# Altium project Inv_filter_v2.PrjPcb
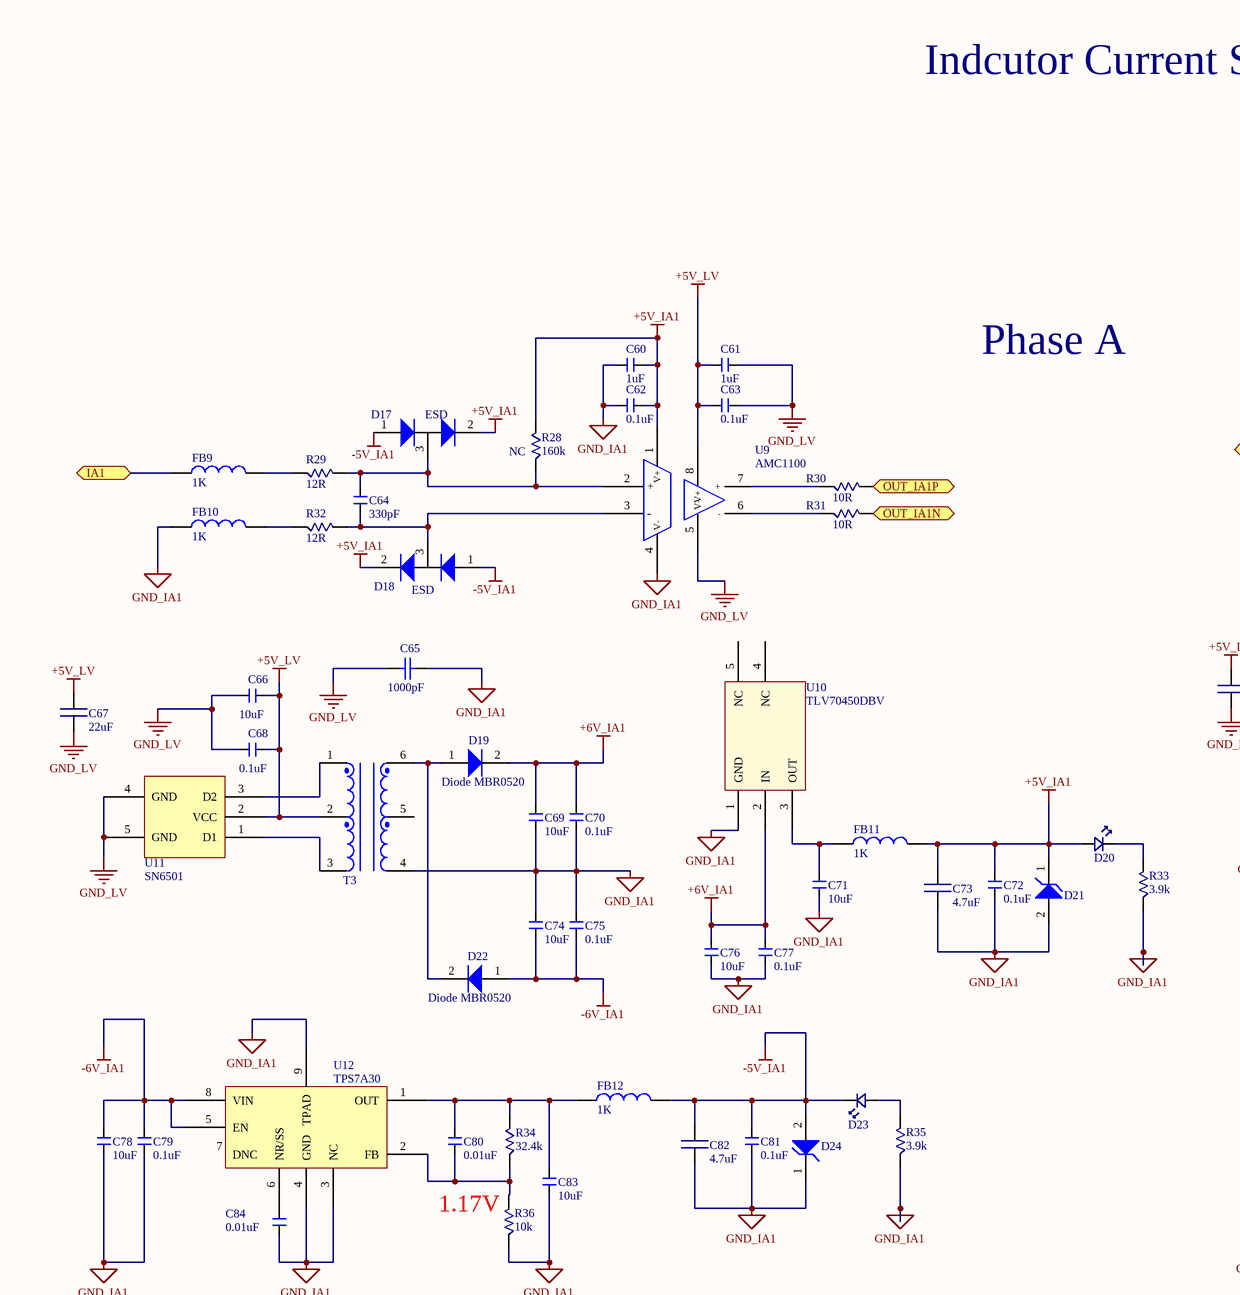
[diagram p0: Ind_current_sensor.SchDoc, top left]
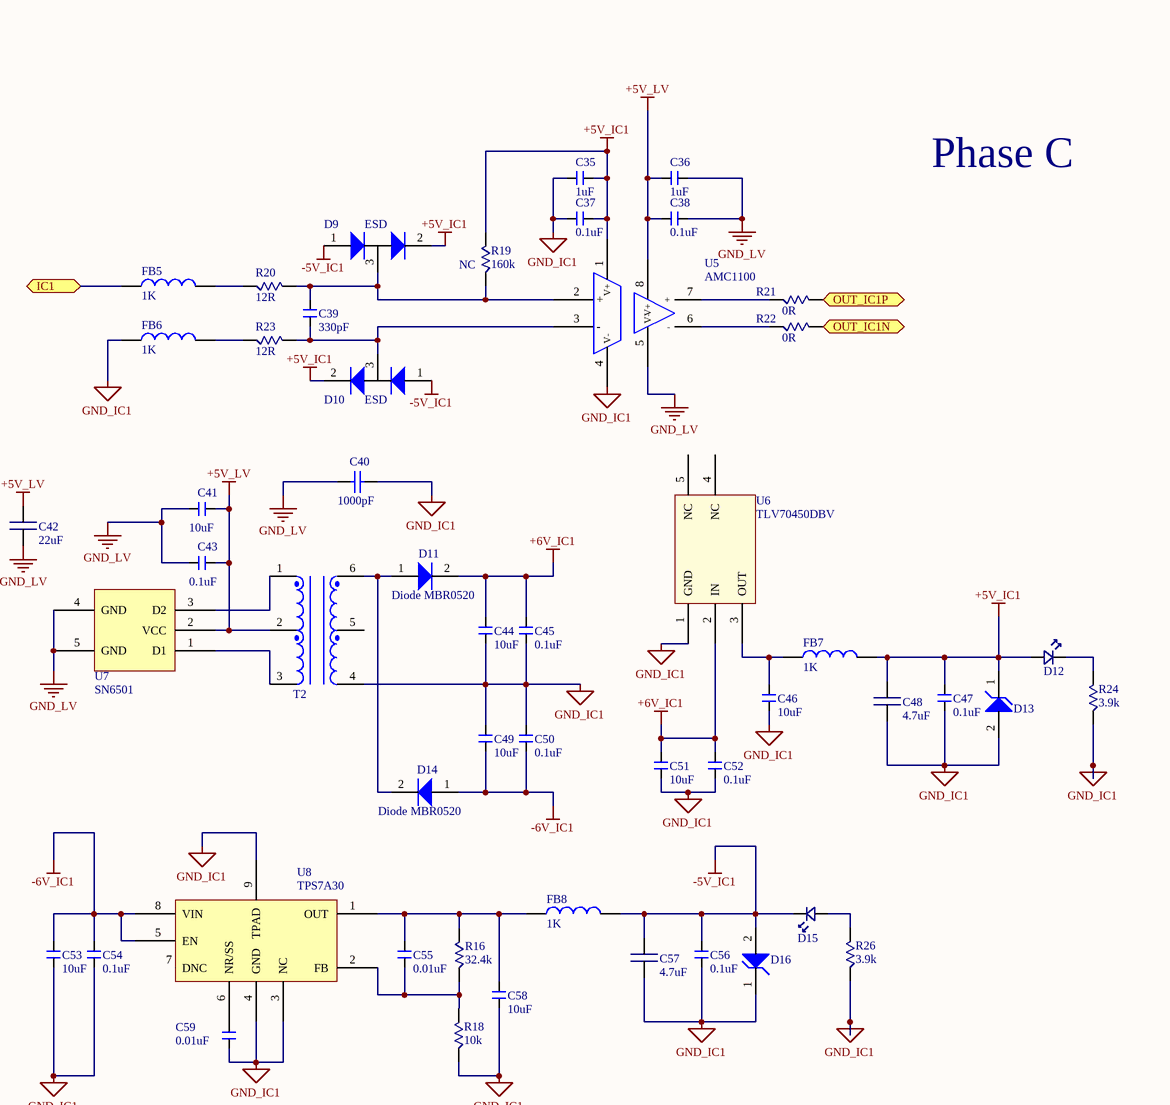
[diagram p1: Ind_current_sensor.SchDoc, top right]
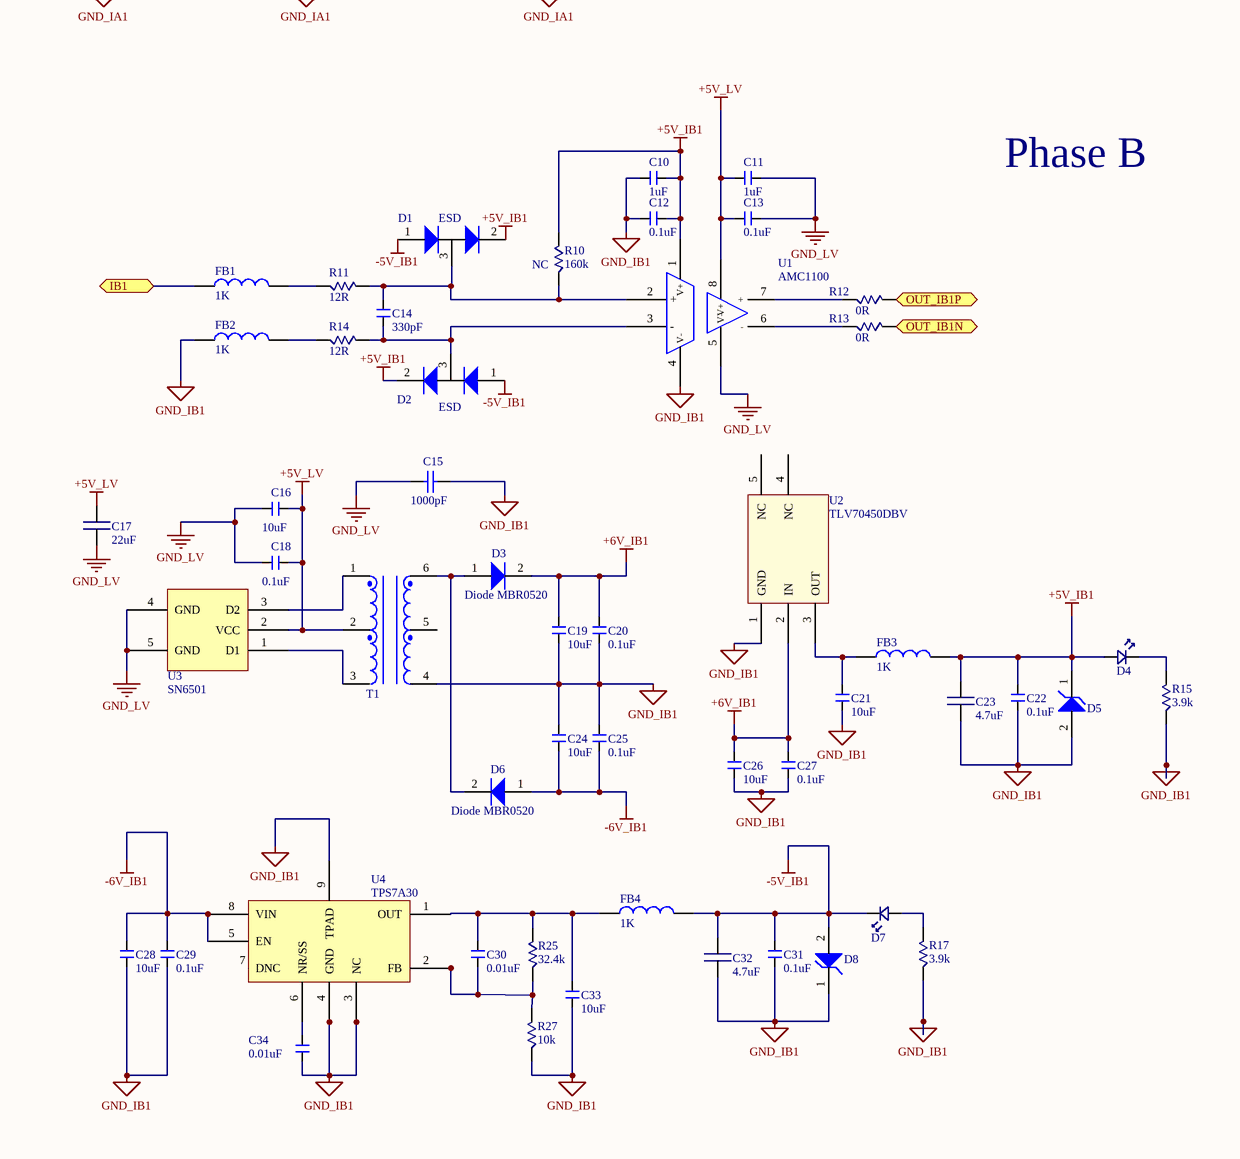
[diagram p2: Ind_current_sensor.SchDoc, bottom left]
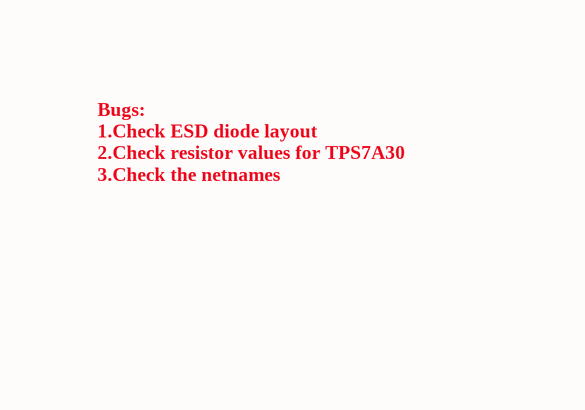
[diagram p3: Ind_current_sensor.SchDoc, bottom right]
3 sheets, 414 parts. Net scope: flat (ports and power ports of the same name join across sheets).
Board file: Inc_filter_v2.PcbDoc
Sheets:
  Ind_current_sensor.SchDoc
  Voltage_sensor_UVW.SchDoc
  Out_current_sensor_UVW.SchDoc

## Sheet Ind_current_sensor.SchDoc
size 508 x 508 mm

### Parts
C10  value 1uF  [0603 (1608 Metric)]  (hidden comment: Cap 0603_new)
C11  value 1uF  [0603 (1608 Metric)]  (hidden comment: Cap 0603_new)
C12  value 0.1uF  [0603 (1608 Metric)]  (hidden comment: Cap 0603_new)
C13  value 0.1uF  [0603 (1608 Metric)]  (hidden comment: Cap 0603_new)
C14  value 330pF  [0603 (1608 Metric)]  (hidden comment: Cap 0603_new)
C15  value 1000pF  [RAD-0.3]  (hidden comment: Cap TH)
C16  value 10uF  [0603 (1608 Metric)]  (hidden comment: Cap 0603_new)
C17  value 22uF  [0805 (2012 metric)]  (hidden comment: Cap 0805)
C18  value 0.1uF  [0603 (1608 Metric)]  (hidden comment: Cap 0603_new)
C19  value 10uF  [0603 (1608 Metric)]  (hidden comment: Cap 0603_new)
C20  value 0.1uF  [0603 (1608 Metric)]  (hidden comment: Cap 0603_new)
C21  value 10uF  [0603 (1608 Metric)]  (hidden comment: Cap 0603_new)
C22  value 0.1uF  [0603 (1608 Metric)]  (hidden comment: Cap 0603_new)
C23  value 4.7uF  [0805 (2012 metric)]  (hidden comment: Cap 0805)
C24  value 10uF  [0603 (1608 Metric)]  (hidden comment: Cap 0603_new)
C25  value 0.1uF  [0603 (1608 Metric)]  (hidden comment: Cap 0603_new)
C26  value 10uF  [0603 (1608 Metric)]  (hidden comment: Cap 0603_new)
C27  value 0.1uF  [0603 (1608 Metric)]  (hidden comment: Cap 0603_new)
C28  value 10uF  [0603 (1608 Metric)]  (hidden comment: Cap 0603_new)
C29  value 0.1uF  [0603 (1608 Metric)]  (hidden comment: Cap 0603_new)
C30  value 0.01uF  [0603 (1608 Metric)]  (hidden comment: Cap 0603_new)
C31  value 0.1uF  [0603 (1608 Metric)]  (hidden comment: Cap 0603_new)
C32  value 4.7uF  [0805 (2012 metric)]  (hidden comment: Cap 0805)
C33  value 10uF  [0603 (1608 Metric)]  (hidden comment: Cap 0603_new)
C34  value 0.01uF  [0603 (1608 Metric)]  (hidden comment: Cap 0603_new)
C35  value 1uF  [0603 (1608 Metric)]  (hidden comment: Cap 0603_new)
C36  value 1uF  [0603 (1608 Metric)]  (hidden comment: Cap 0603_new)
C37  value 0.1uF  [0603 (1608 Metric)]  (hidden comment: Cap 0603_new)
C38  value 0.1uF  [0603 (1608 Metric)]  (hidden comment: Cap 0603_new)
C39  value 330pF  [0603 (1608 Metric)]  (hidden comment: Cap 0603_new)
C40  value 1000pF  [RAD-0.3]  (hidden comment: Cap TH)
C41  value 10uF  [0603 (1608 Metric)]  (hidden comment: Cap 0603_new)
C42  value 22uF  [0805 (2012 metric)]  (hidden comment: Cap 0805)
C43  value 0.1uF  [0603 (1608 Metric)]  (hidden comment: Cap 0603_new)
C44  value 10uF  [0603 (1608 Metric)]  (hidden comment: Cap 0603_new)
C45  value 0.1uF  [0603 (1608 Metric)]  (hidden comment: Cap 0603_new)
C46  value 10uF  [0603 (1608 Metric)]  (hidden comment: Cap 0603_new)
C47  value 0.1uF  [0603 (1608 Metric)]  (hidden comment: Cap 0603_new)
C48  value 4.7uF  [0805 (2012 metric)]  (hidden comment: Cap 0805)
C49  value 10uF  [0603 (1608 Metric)]  (hidden comment: Cap 0603_new)
C50  value 0.1uF  [0603 (1608 Metric)]  (hidden comment: Cap 0603_new)
C51  value 10uF  [0603 (1608 Metric)]  (hidden comment: Cap 0603_new)
C52  value 0.1uF  [0603 (1608 Metric)]  (hidden comment: Cap 0603_new)
C53  value 10uF  [0603 (1608 Metric)]  (hidden comment: Cap 0603_new)
C54  value 0.1uF  [0603 (1608 Metric)]  (hidden comment: Cap 0603_new)
C55  value 0.01uF  [0603 (1608 Metric)]  (hidden comment: Cap 0603_new)
C56  value 0.1uF  [0603 (1608 Metric)]  (hidden comment: Cap 0603_new)
C57  value 4.7uF  [0805 (2012 metric)]  (hidden comment: Cap 0805)
C58  value 10uF  [0603 (1608 Metric)]  (hidden comment: Cap 0603_new)
C59  value 0.01uF  [0603 (1608 Metric)]  (hidden comment: Cap 0603_new)
C60  value 1uF  [0603 (1608 Metric)]  (hidden comment: Cap 0603_new)
C61  value 1uF  [0603 (1608 Metric)]  (hidden comment: Cap 0603_new)
C62  value 0.1uF  [0603 (1608 Metric)]  (hidden comment: Cap 0603_new)
C63  value 0.1uF  [0603 (1608 Metric)]  (hidden comment: Cap 0603_new)
C64  value 330pF  [0603 (1608 Metric)]  (hidden comment: Cap 0603_new)
C65  value 1000pF  [RAD-0.3]  (hidden comment: Cap TH)
C66  value 10uF  [0603 (1608 Metric)]  (hidden comment: Cap 0603_new)
C67  value 22uF  [0805 (2012 metric)]  (hidden comment: Cap 0805)
C68  value 0.1uF  [0603 (1608 Metric)]  (hidden comment: Cap 0603_new)
C69  value 10uF  [0603 (1608 Metric)]  (hidden comment: Cap 0603_new)
C70  value 0.1uF  [0603 (1608 Metric)]  (hidden comment: Cap 0603_new)
C71  value 10uF  [0603 (1608 Metric)]  (hidden comment: Cap 0603_new)
C72  value 0.1uF  [0603 (1608 Metric)]  (hidden comment: Cap 0603_new)
C73  value 4.7uF  [0805 (2012 metric)]  (hidden comment: Cap 0805)
C74  value 10uF  [0603 (1608 Metric)]  (hidden comment: Cap 0603_new)
C75  value 0.1uF  [0603 (1608 Metric)]  (hidden comment: Cap 0603_new)
C76  value 10uF  [0603 (1608 Metric)]  (hidden comment: Cap 0603_new)
C77  value 0.1uF  [0603 (1608 Metric)]  (hidden comment: Cap 0603_new)
C78  value 10uF  [0603 (1608 Metric)]  (hidden comment: Cap 0603_new)
C79  value 0.1uF  [0603 (1608 Metric)]  (hidden comment: Cap 0603_new)
C80  value 0.01uF  [0603 (1608 Metric)]  (hidden comment: Cap 0603_new)
C81  value 0.1uF  [0603 (1608 Metric)]  (hidden comment: Cap 0603_new)
C82  value 4.7uF  [0805 (2012 metric)]  (hidden comment: Cap 0805)
C83  value 10uF  [0603 (1608 Metric)]  (hidden comment: Cap 0603_new)
C84  value 0.01uF  [0603 (1608 Metric)]  (hidden comment: Cap 0603_new)
D1  value ESD  [SOT323_ESD]  (hidden comment: TVS - Diodes)
D2  value ESD  [SOT323_ESD]  (hidden comment: TVS - Diodes)
D3  Diode MBR0520  [SOD-123]
D4  LED  [0805 (2012 Metric) Diode]  (value not drawn)
D5  Diode Zener POWERDI123  [POWERDI]  (value not drawn)
D6  Diode MBR0520  [SOD-123]
D7  LED  [0805 (2012 Metric) Diode]  (value not drawn)
D8  Diode Zener POWERDI123  [POWERDI]  (value not drawn)
D9  value ESD  [SOT323_ESD]  (hidden comment: TVS - Diodes)
D10  value ESD  [SOT323_ESD]  (hidden comment: TVS - Diodes)
D11  Diode MBR0520  [SOD-123]
D12  LED  [0805 (2012 Metric) Diode]  (value not drawn)
D13  Diode Zener POWERDI123  [POWERDI]  (value not drawn)
D14  Diode MBR0520  [SOD-123]
D15  LED  [0805 (2012 Metric) Diode]  (value not drawn)
D16  Diode Zener POWERDI123  [POWERDI]  (value not drawn)
D17  value ESD  [SOT323_ESD]  (hidden comment: TVS - Diodes)
D18  value ESD  [SOT323_ESD]  (hidden comment: TVS - Diodes)
D19  Diode MBR0520  [SOD-123]
D20  LED  [0805 (2012 Metric) Diode]  (value not drawn)
D21  Diode Zener POWERDI123  [POWERDI]  (value not drawn)
D22  Diode MBR0520  [SOD-123]
D23  LED  [0805 (2012 Metric) Diode]  (value not drawn)
D24  Diode Zener POWERDI123  [POWERDI]  (value not drawn)
FB1  value 1K  [0603 (1608 Metric)]  (hidden comment: Ferrite bead)
FB2  value 1K  [0603 (1608 Metric)]  (hidden comment: Ferrite bead)
FB3  value 1K  [0603 (1608 Metric)]  (hidden comment: Ferrite bead)
FB4  value 1K  [0603 (1608 Metric)]  (hidden comment: Ferrite bead)
FB5  value 1K  [0603 (1608 Metric)]  (hidden comment: Ferrite bead)
FB6  value 1K  [0603 (1608 Metric)]  (hidden comment: Ferrite bead)
FB7  value 1K  [0603 (1608 Metric)]  (hidden comment: Ferrite bead)
FB8  value 1K  [0603 (1608 Metric)]  (hidden comment: Ferrite bead)
FB9  value 1K  [0603 (1608 Metric)]  (hidden comment: Ferrite bead)
FB10  value 1K  [0603 (1608 Metric)]  (hidden comment: Ferrite bead)
FB11  value 1K  [0603 (1608 Metric)]  (hidden comment: Ferrite bead)
FB12  value 1K  [0603 (1608 Metric)]  (hidden comment: Ferrite bead)
R10  NC  value 160k  [0603 (1608 Metric)]
R11  value 12R  [1206]  (hidden comment: Resistor 1206)
R12  value 0R  [0603 (1608 Metric)]  (hidden comment: Resistor 0603)
R13  value 0R  [0603 (1608 Metric)]  (hidden comment: Resistor 0603)
R14  value 12R  [1206]  (hidden comment: Resistor 1206)
R15  value 3.9k  [0603 (1608 Metric)]  (hidden comment: Resistor 0603)
R16  value 32.4k  [0603 (1608 Metric)]  (hidden comment: Resistor 0603)
R17  value 3.9k  [0603 (1608 Metric)]  (hidden comment: Resistor 0603)
R18  value 10k  [0603 (1608 Metric)]  (hidden comment: Resistor 0603)
R19  NC  value 160k  [0603 (1608 Metric)]
R20  value 12R  [1206]  (hidden comment: Resistor 1206)
R21  value 0R  [0603 (1608 Metric)]  (hidden comment: Resistor 0603)
R22  value 0R  [0603 (1608 Metric)]  (hidden comment: Resistor 0603)
R23  value 12R  [1206]  (hidden comment: Resistor 1206)
R24  value 3.9k  [0603 (1608 Metric)]  (hidden comment: Resistor 0603)
R25  value 32.4k  [0603 (1608 Metric)]  (hidden comment: Resistor 0603)
R26  value 3.9k  [0603 (1608 Metric)]  (hidden comment: Resistor 0603)
R27  value 10k  [0603 (1608 Metric)]  (hidden comment: Resistor 0603)
R28  NC  value 160k  [0603 (1608 Metric)]
R29  value 12R  [1206]  (hidden comment: Resistor 1206)
R30  value 10R  [0603 (1608 Metric)]  (hidden comment: Resistor 0603)
R31  value 10R  [0603 (1608 Metric)]  (hidden comment: Resistor 0603)
R32  value 12R  [1206]  (hidden comment: Resistor 1206)
R33  value 3.9k  [0603 (1608 Metric)]  (hidden comment: Resistor 0603)
R34  value 32.4k  [0603 (1608 Metric)]  (hidden comment: Resistor 0603)
R35  value 3.9k  [0603 (1608 Metric)]  (hidden comment: Resistor 0603)
R36  value 10k  [0603 (1608 Metric)]  (hidden comment: Resistor 0603)
T1  750313769  [Xmr SN6501]  (value not drawn)
T2  750313769  [Xmr SN6501]  (value not drawn)
T3  750313769  [Xmr SN6501]  (value not drawn)
U1  AMC1100  [SOIC8]
U2  TLV70450DBV  [SOT23-5]
U3  SN6501  [SOT23-5]
U4  TPS7A30  [8-TSSOP]
U5  AMC1100  [SOIC8]
U6  TLV70450DBV  [SOT23-5]
U7  SN6501  [SOT23-5]
U8  TPS7A30  [8-TSSOP]
U9  AMC1100  [SOIC8]
U10  TLV70450DBV  [SOT23-5]
U11  SN6501  [SOT23-5]
U12  TPS7A30  [8-TSSOP]

### Ports
IA1, IB1, IC1, OUT_IA1N, OUT_IA1P, OUT_IB1N, OUT_IB1P, OUT_IC1N, OUT_IC1P

### Nets
+5V_IA1: C60.2(OUT) C62.2(OUT) C72.2(OUT) C73.2(OUT) D17.2(node) D18.2(node) D20.A D21.1(Anode) FB11.2(OUT) R28.2(A) U9.1(V+)
+5V_IB1: C10.2(OUT) C12.2(OUT) C22.2(OUT) C23.2(OUT) D1.2(node) D2.2(node) D4.A D5.1(Anode) FB3.2(OUT) R10.2(A) U1.1(V+)
+5V_IC1: C35.2(OUT) C37.2(OUT) C47.2(OUT) C48.2(OUT) D9.2(node) D10.2(node) D12.A D13.1(Anode) FB7.2(OUT) R19.2(A) U5.1(V+)
+5V_LV: C11.1(OUT) C13.1(OUT) C16.2(OUT) C17.2(OUT) C18.2(OUT) C36.1(OUT) C38.1(OUT) C41.2(OUT) C42.2(OUT) C43.2(OUT) C61.1(OUT) C63.1(OUT) C66.2(OUT) C67.2(OUT) C68.2(OUT) T1.2 T2.2 T3.2 U1.8(V+) U3.2(VCC) U5.8(V+) U7.2(VCC) U9.8(V+) U11.2(VCC)
+6V_IA1: C69.2(OUT) C70.2(OUT) C76.2(OUT) C77.2(OUT) D19.2(Anode) U10.2(IN)
+6V_IB1: C19.2(OUT) C20.2(OUT) C26.2(OUT) C27.2(OUT) D3.2(Anode) U2.2(IN)
+6V_IC1: C44.2(OUT) C45.2(OUT) C51.2(OUT) C52.2(OUT) D11.2(Anode) U6.2(IN)
-5V_IA1: C81.2(OUT) C82.2(OUT) D17.1(node) D18.1(node) D23.K D24.2(Anode) FB12.2(OUT)
-5V_IB1: C31.2(OUT) C32.2(OUT) D1.1(node) D2.1(node) D7.K D8.2(Anode) FB4.2(OUT)
-5V_IC1: C56.2(OUT) C57.2(OUT) D9.1(node) D10.1(node) D15.K D16.2(Anode) FB8.2(OUT)
-6V_IA1: C74.1(OUT) C75.1(OUT) C78.2(OUT) C79.2(OUT) D22.1(Anode) U12.5(EN) U12.8(VIN)
-6V_IB1: C24.1(OUT) C25.1(OUT) C28.2(OUT) C29.2(OUT) D6.1(Anode) U4.5(EN) U4.8(VIN)
-6V_IC1: C49.1(OUT) C50.1(OUT) C53.2(OUT) C54.2(OUT) D14.1(Anode) U8.5(EN) U8.8(VIN)
GND_IA1: C60.1(OUT) C62.1(OUT) C65.2 C69.1(OUT) C70.1(OUT) C71.1(OUT) C72.1(OUT) C73.1(OUT) C74.2(OUT) C75.2(OUT) C76.1(OUT) C77.1(OUT) C78.1(OUT) C79.1(OUT) C81.1(OUT) C82.1(OUT) C83.1(OUT) C84.1(OUT) D21.2(Anode) D24.1(Anode) FB10.1(OUT) R33.1(A) R35.1(A) R36.1(A) T3.4 U9.4(V-) U10.1(GND) U12.3(NC) U12.4(GND) U12.9(TPAD)
GND_IB1: C10.1(OUT) C12.1(OUT) C15.2 C19.1(OUT) C20.1(OUT) C21.1(OUT) C22.1(OUT) C23.1(OUT) C24.2(OUT) C25.2(OUT) C26.1(OUT) C27.1(OUT) C28.1(OUT) C29.1(OUT) C31.1(OUT) C32.1(OUT) C33.1(OUT) C34.1(OUT) D5.2(Anode) D8.1(Anode) FB2.1(OUT) R15.1(A) R17.1(A) R27.1(A) T1.4 U1.4(V-) U2.1(GND) U4.3(NC) U4.4(GND) U4.9(TPAD)
GND_IC1: C35.1(OUT) C37.1(OUT) C40.2 C44.1(OUT) C45.1(OUT) C46.1(OUT) C47.1(OUT) C48.1(OUT) C49.2(OUT) C50.2(OUT) C51.1(OUT) C52.1(OUT) C53.1(OUT) C54.1(OUT) C56.1(OUT) C57.1(OUT) C58.1(OUT) C59.1(OUT) D13.2(Anode) D16.1(Anode) FB6.1(OUT) R18.1(A) R24.1(A) R26.1(A) T2.4 U5.4(V-) U6.1(GND) U8.3(NC) U8.4(GND) U8.9(TPAD)
GND_LV: C11.2(OUT) C13.2(OUT) C15.1 C16.1(OUT) C17.1(OUT) C18.1(OUT) C36.2(OUT) C38.2(OUT) C40.1 C41.1(OUT) C42.1(OUT) C43.1(OUT) C61.2(OUT) C63.2(OUT) C65.1 C66.1(OUT) C67.1(OUT) C68.1(OUT) U1.5(V-) U3.4(GND) U3.5(GND) U5.5(V-) U7.4(GND) U7.5(GND) U9.5(V-) U11.4(GND) U11.5(GND)
NetC14_1: C14.1(OUT) D1.3(node) R10.1(A) R11.2(A) U1.2(+)
NetC14_2: C14.2(OUT) D2.3(node) R14.2(A) U1.3(-)
NetC21_2: C21.2(OUT) FB3.1(OUT) U2.3(OUT)
NetC30_1: C30.1(OUT) C33.2(OUT) FB4.1(OUT) R25.2(A) U4.1(OUT)
NetC30_2: C30.2(OUT) R25.1(A) R27.2(A) U4.2(FB)
NetC34_2: C34.2(OUT) U4.6(NR/SS)
NetC39_1: C39.1(OUT) D9.3(node) R19.1(A) R20.2(A) U5.2(+)
NetC39_2: C39.2(OUT) D10.3(node) R23.2(A) U5.3(-)
NetC46_2: C46.2(OUT) FB7.1(OUT) U6.3(OUT)
NetC55_1: C55.1(OUT) C58.2(OUT) FB8.1(OUT) R16.2(A) U8.1(OUT)
NetC55_2: C55.2(OUT) R16.1(A) R18.2(A) U8.2(FB)
NetC59_2: C59.2(OUT) U8.6(NR/SS)
NetC64_1: C64.1(OUT) D17.3(node) R28.1(A) R29.2(A) U9.2(+)
NetC64_2: C64.2(OUT) D18.3(node) R32.2(A) U9.3(-)
NetC71_2: C71.2(OUT) FB11.1(OUT) U10.3(OUT)
NetC80_1: C80.1(OUT) C83.2(OUT) FB12.1(OUT) R34.2(A) U12.1(OUT)
NetC80_2: C80.2(OUT) R34.1(A) R36.2(A) U12.2(FB)
NetC84_2: C84.2(OUT) U12.6(NR/SS)
NetD3_1: D3.1(Anode) D6.2(Anode) T1.6
NetD4_K: D4.K R15.2(A)
NetD7_A: D7.A R17.2(A)
NetD11_1: D11.1(Anode) D14.2(Anode) T2.6
NetD12_K: D12.K R24.2(A)
NetD15_A: D15.A R26.2(A)
NetD19_1: D19.1(Anode) D22.2(Anode) T3.6
NetD20_K: D20.K R33.2(A)
NetD23_A: D23.A R35.2(A)
NetFB1_1: FB1.1(OUT) ; port IB1
NetFB1_2: FB1.2(OUT) R11.1(A)
NetFB2_2: FB2.2(OUT) R14.1(A)
NetFB5_1: FB5.1(OUT) ; port IC1
NetFB5_2: FB5.2(OUT) R20.1(A)
NetFB6_2: FB6.2(OUT) R23.1(A)
NetFB9_1: FB9.1(OUT) ; port IA1
NetFB9_2: FB9.2(OUT) R29.1(A)
NetFB10_2: FB10.2(OUT) R32.1(A)
NetR12_1: R12.1(A) U1.7(+)
NetR12_2: R12.2(A) ; port OUT_IB1P
NetR13_1: R13.1(A) U1.6(-)
NetR13_2: R13.2(A) ; port OUT_IB1N
NetR21_1: R21.1(A) U5.7(+)
NetR21_2: R21.2(A) ; port OUT_IC1P
NetR22_1: R22.1(A) U5.6(-)
NetR22_2: R22.2(A) ; port OUT_IC1N
NetR30_1: R30.1(A) U9.7(+)
NetR30_2: R30.2(A) ; port OUT_IA1P
NetR31_1: R31.1(A) U9.6(-)
NetR31_2: R31.2(A) ; port OUT_IA1N
NetT1_1: T1.1 U3.3(D2)
NetT1_3: T1.3 U3.1(D1)
NetT2_1: T2.1 U7.3(D2)
NetT2_3: T2.3 U7.1(D1)
NetT3_1: T3.1 U11.3(D2)
NetT3_3: T3.3 U11.1(D1)

Not connected (* = marked no-connect by the designer): T1 5(1); T2 5(1); T3 5(1); U2 4(NC) 5(NC); U4 7(DNC); U6 4(NC) 5(NC); U8 7(DNC); U10 4(NC) 5(NC); U12 7(DNC)

### Notes on the sheet
- Indcutor Current Sensors
- Phase C
- Phase A
- (near R36) 1.17V
- Phase B
- Bugs:
  1.Check ESD diode layout
  2.Check resistor values for TPS7A30
  3.Check the netnames

### Library data of the parts
C10 C11 C35 C36 C60 C61 = Cap 0603_new: CAP CER 1UF 50V X5R 0603; part: 1276-1860-1-ND
C12 C13 C18 C20 C22 C25 C27 C29 C31 C37 C38 C43 C45 C47 C50 C52 C54 C56 C62 C63 C68 C70 C72 C75 C77 C79 C81 = Cap 0603_new: CAP CER 0.1UF 50V Y5V 0603; part: 311-1343-6-ND
C14 C39 C64 = Cap 0603_new: CAP CER 330PF 50V C0G 0603; part: 445-7033-2-ND
C15 C40 C65 = Cap: CAP CER 1000PF 1KV Y5P RADIAL; Part: 1251PH-ND; Published: 8-Jun-2000; LatestRevisionDate: 17-Jul-2002; LatestRevisionNote: Re-released for DXP Platform.; PackageReference: RAD-0.3; Publisher: Altium Limited; PackageDescription: Radial Cap, Thru-Hole; 2 Leads; 0.3 in Pin Spacing
C16 C19 C21 C24 C26 C28 C33 C41 C44 C46 C49 C51 C53 C58 C66 C69 C71 C74 C76 C78 C83 = Cap 0603_new: CAP CER 10UF 35V X5R 0805; part: 490-10515-1-ND
C17 C42 C67 = Cap 0805: CAP CER 22UF 35V X5R 0805; Part: 445-14428-1-ND
C23 C32 C48 C57 C73 C82 = Cap 0805: CAP CER 4.7UF 50V X5R 0805; Part: 445-5980-1-ND
C30 C34 C55 C59 C80 C84 = Cap 0603_new: CAP CER 10000PF 100V X7R 0603; part: 478-7418-1-ND
D1 D2 D9 D10 D17 D18 = Diode_ESD: TVS DIODE; Part: ESD1P0RFWH6327XTSA1CT
D3 D6 D11 D14 D19 D22 = Diode MBR0520: DIODE SCHOTTKY 20V 500MA SOD123; Part: MBR0520LT1GOSCT-ND; Value: *
D4 D7 D12 D15 D20 D23 = LED: LED 0805
D5 D8 D13 D16 D21 D24 = Diode Zener POWERDI123: Part: DFLZ6V2DICT-ND; Value: *
FB1-FB12 = Ferrite bead: FERRITE BEAD 1 KOHM 0603 1LN; Part: 445-8672-1-ND
R10 R19 R28 = Resistor 0603
R11 R14 R20 R23 R29 R32 = Resistor 1206: 12 Ohm ±0.5% 0.25W, 1/4W Chip Resistor 1206; Part: 311-2961-1-ND
R12 R13 R21 R22 R30 R31 = Resistor 0603: RES SMD 10 OHM 0.05% 1/10W 0603; Part: RNCF0603AKT10R0CT-ND
R15 R17 R24 R26 R33 R35 = Resistor 0603: RES SMD 3.9K OHM 5% 1/10W 0603; Part: 541-3.9KGCT-ND
R16 R25 R34 = Resistor 0603: RES SMD 32.4KOHM 0.5% 1/10W 0603; Part: 311-32.4KDCT-ND
R18 R27 R36 = Resistor 0603: RES SMD 10K OHM 0.5% 1/16W 0603; Part: RR08P10.0KDCT-ND
T1-T3 = 750313769: TRANSFORMER SMD TR1.7 SN6501; Part: 1297-1107-1-ND
U1 U5 U9 = AMC1100: IC OPAMP ISOLATION 100KHZ 8SOIC; Part: 296-38822-5-ND
U2 U6 U10 = TLV70450DBV: IC REG LDO 5V 0.15A SOT23-5; Part: 296-39287-1-ND
U3 U7 U11 = SN6501: IC REG CONV PWR SUPPLIES SOT23-5; Part: 296-37700-1-ND; Value: *
U4 U8 U12 = TPS7A30: IC REG LDO NEG ADJ 0.2A 8MSOP; Part: 296-27750-1-ND

## Sheet Voltage_sensor_UVW.SchDoc
size 381 x 457 mm
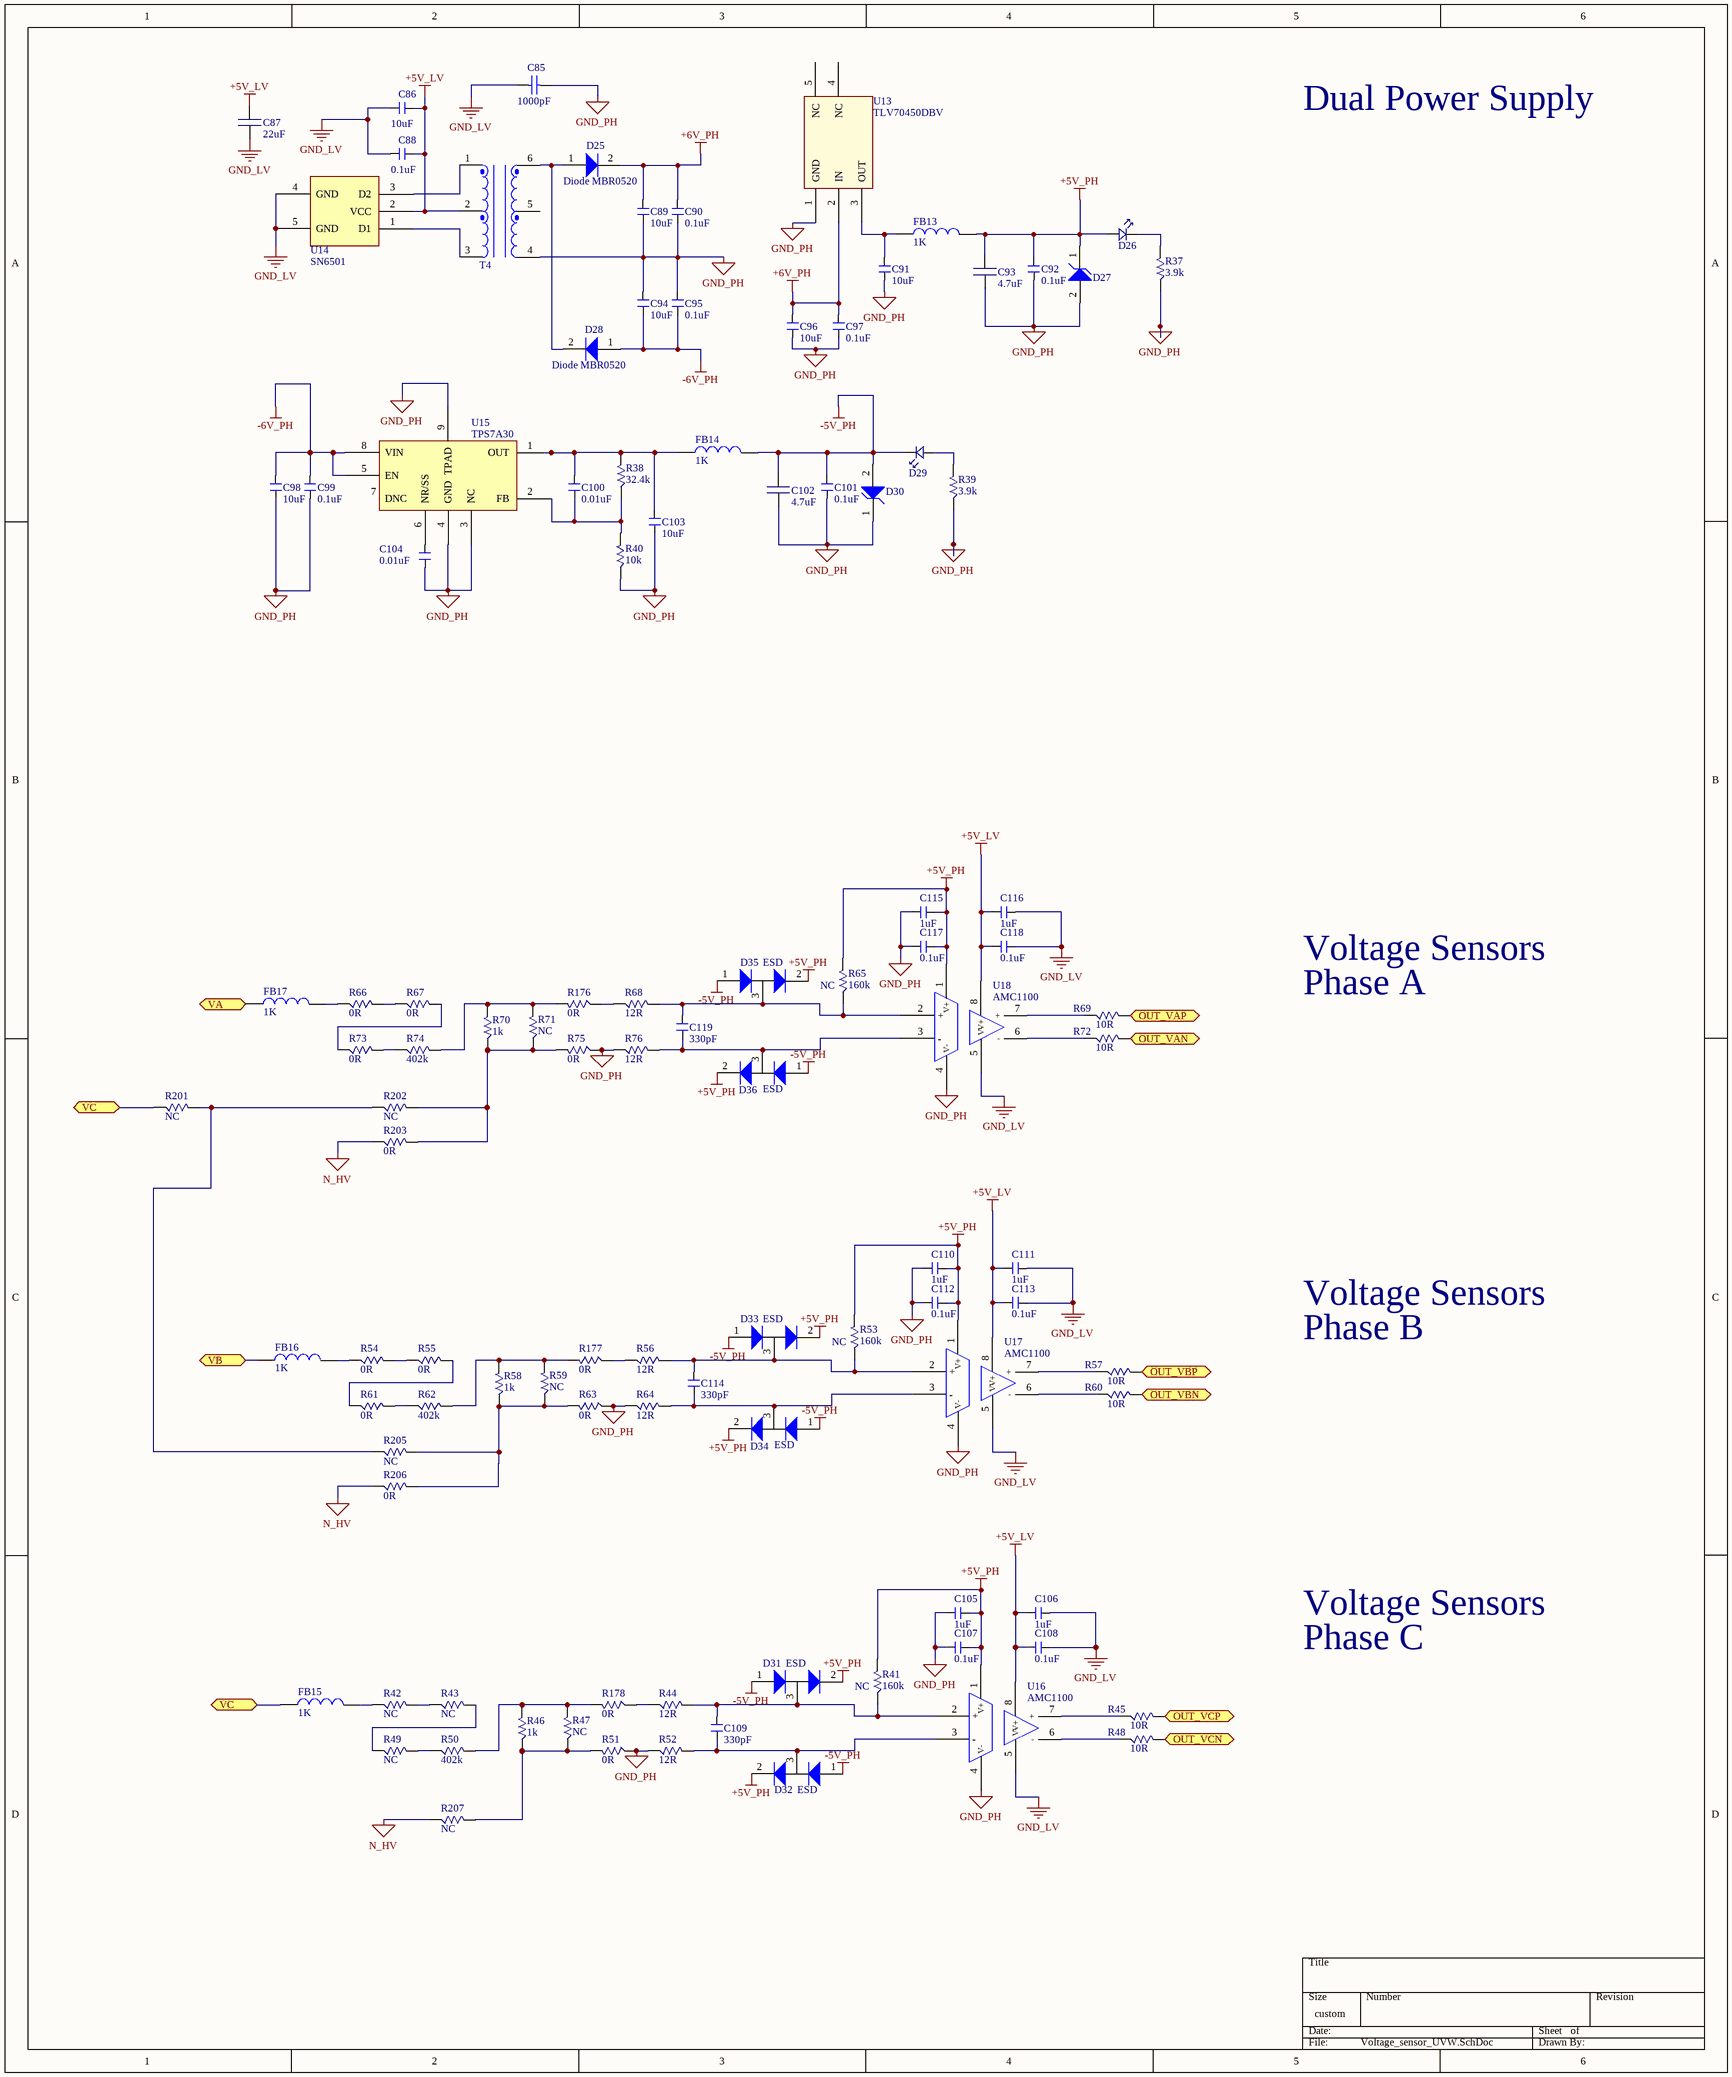
[diagram p4: Voltage_sensor_UVW.SchDoc]

### Parts
C85  value 1000pF  [RAD-0.3]  (hidden comment: Cap TH)
C86  value 10uF  [0603 (1608 Metric)]  (hidden comment: Cap 0603_new)
C87  value 22uF  [0805 (2012 metric)]  (hidden comment: Cap 0805)
C88  value 0.1uF  [0603 (1608 Metric)]  (hidden comment: Cap 0603_new)
C89  value 10uF  [0603 (1608 Metric)]  (hidden comment: Cap 0603_new)
C90  value 0.1uF  [0603 (1608 Metric)]  (hidden comment: Cap 0603_new)
C91  value 10uF  [0603 (1608 Metric)]  (hidden comment: Cap 0603_new)
C92  value 0.1uF  [0603 (1608 Metric)]  (hidden comment: Cap 0603_new)
C93  value 4.7uF  [0805 (2012 metric)]  (hidden comment: Cap 0805)
C94  value 10uF  [0603 (1608 Metric)]  (hidden comment: Cap 0603_new)
C95  value 0.1uF  [0603 (1608 Metric)]  (hidden comment: Cap 0603_new)
C96  value 10uF  [0603 (1608 Metric)]  (hidden comment: Cap 0603_new)
C97  value 0.1uF  [0603 (1608 Metric)]  (hidden comment: Cap 0603_new)
C98  value 10uF  [0603 (1608 Metric)]  (hidden comment: Cap 0603_new)
C99  value 0.1uF  [0603 (1608 Metric)]  (hidden comment: Cap 0603_new)
C100  value 0.01uF  [0603 (1608 Metric)]  (hidden comment: Cap 0603_new)
C101  value 0.1uF  [0603 (1608 Metric)]  (hidden comment: Cap 0603_new)
C102  value 4.7uF  [0805 (2012 metric)]  (hidden comment: Cap 0805)
C103  value 10uF  [0603 (1608 Metric)]  (hidden comment: Cap 0603_new)
C104  value 0.01uF  [0603 (1608 Metric)]  (hidden comment: Cap 0603_new)
C105  value 1uF  [0603 (1608 Metric)]  (hidden comment: Cap 0603_new)
C106  value 1uF  [0603 (1608 Metric)]  (hidden comment: Cap 0603_new)
C107  value 0.1uF  [0603 (1608 Metric)]  (hidden comment: Cap 0603_new)
C108  value 0.1uF  [0603 (1608 Metric)]  (hidden comment: Cap 0603_new)
C109  value 330pF  [0603 (1608 Metric)]  (hidden comment: Cap 0603_new)
C110  value 1uF  [0603 (1608 Metric)]  (hidden comment: Cap 0603_new)
C111  value 1uF  [0603 (1608 Metric)]  (hidden comment: Cap 0603_new)
C112  value 0.1uF  [0603 (1608 Metric)]  (hidden comment: Cap 0603_new)
C113  value 0.1uF  [0603 (1608 Metric)]  (hidden comment: Cap 0603_new)
C114  value 330pF  [0603 (1608 Metric)]  (hidden comment: Cap 0603_new)
C115  value 1uF  [0603 (1608 Metric)]  (hidden comment: Cap 0603_new)
C116  value 1uF  [0603 (1608 Metric)]  (hidden comment: Cap 0603_new)
C117  value 0.1uF  [0603 (1608 Metric)]  (hidden comment: Cap 0603_new)
C118  value 0.1uF  [0603 (1608 Metric)]  (hidden comment: Cap 0603_new)
C119  value 330pF  [0603 (1608 Metric)]  (hidden comment: Cap 0603_new)
D25  Diode MBR0520  [SOD-123]
D26  LED  [0805 (2012 Metric) Diode]  (value not drawn)
D27  Diode Zener POWERDI123  [POWERDI]  (value not drawn)
D28  Diode MBR0520  [SOD-123]
D29  LED  [0805 (2012 Metric) Diode]  (value not drawn)
D30  Diode Zener POWERDI123  [POWERDI]  (value not drawn)
D31  value ESD  [SOT323_ESD]  (hidden comment: TVS - Diodes)
D32  value ESD  [SOT323_ESD]  (hidden comment: TVS - Diodes)
D33  value ESD  [SOT323_ESD]  (hidden comment: TVS - Diodes)
D34  value ESD  [SOT323_ESD]  (hidden comment: TVS - Diodes)
D35  value ESD  [SOT323_ESD]  (hidden comment: TVS - Diodes)
D36  value ESD  [SOT323_ESD]  (hidden comment: TVS - Diodes)
FB13  value 1K  [0603 (1608 Metric)]  (hidden comment: Ferrite bead)
FB14  value 1K  [0603 (1608 Metric)]  (hidden comment: Ferrite bead)
FB15  value 1K  [0603 (1608 Metric)]  (hidden comment: Ferrite bead)
FB16  value 1K  [0603 (1608 Metric)]  (hidden comment: Ferrite bead)
FB17  value 1K  [0603 (1608 Metric)]  (hidden comment: Ferrite bead)
R37  value 3.9k  [0603 (1608 Metric)]  (hidden comment: Resistor 0603)
R38  value 32.4k  [0603 (1608 Metric)]  (hidden comment: Resistor 0603)
R39  value 3.9k  [0603 (1608 Metric)]  (hidden comment: Resistor 0603)
R40  value 10k  [0603 (1608 Metric)]  (hidden comment: Resistor 0603)
R41  NC  value 160k  [0603 (1608 Metric)]
R42  value NC  [1206]  (hidden comment: Resistor 1206)
R43  value NC  [1206]  (hidden comment: Resistor 1206)
R44  value 12R  [1206]  (hidden comment: Resistor 1206)
R45  value 10R  [0603 (1608 Metric)]  (hidden comment: Resistor 0603)
R46  value 1k  [1206]  (hidden comment: Resistor 1206)
R47  value NC  [1206]  (hidden comment: Resistor 1206)
R48  value 10R  [0603 (1608 Metric)]  (hidden comment: Resistor 0603)
R49  value NC  [1206]  (hidden comment: Resistor 1206)
R50  value 402k  [1206]  (hidden comment: Resistor 1206)
R51  value 0R  [0603 (1608 Metric)]  (hidden comment: Resistor 0603)
R52  value 12R  [1206]  (hidden comment: Resistor 1206)
R53  NC  value 160k  [0603 (1608 Metric)]
R54  value 0R  [1206]  (hidden comment: Resistor 1206)
R55  value 0R  [1206]  (hidden comment: Resistor 1206)
R56  value 12R  [1206]  (hidden comment: Resistor 1206)
R57  value 10R  [0603 (1608 Metric)]  (hidden comment: Resistor 0603)
R58  value 1k  [1206]  (hidden comment: Resistor 1206)
R59  value NC  [1206]  (hidden comment: Resistor 1206)
R60  value 10R  [0603 (1608 Metric)]  (hidden comment: Resistor 0603)
R61  value 0R  [1206]  (hidden comment: Resistor 1206)
R62  value 402k  [1206]  (hidden comment: Resistor 1206)
R63  value 0R  [0603 (1608 Metric)]  (hidden comment: Resistor 0603)
R64  value 12R  [1206]  (hidden comment: Resistor 1206)
R65  NC  value 160k  [0603 (1608 Metric)]
R66  value 0R  [1206]  (hidden comment: Resistor 1206)
R67  value 0R  [1206]  (hidden comment: Resistor 1206)
R68  value 12R  [1206]  (hidden comment: Resistor 1206)
R69  value 10R  [0603 (1608 Metric)]  (hidden comment: Resistor 0603)
R70  value 1k  [1206]  (hidden comment: Resistor 1206)
R71  value NC  [1206]  (hidden comment: Resistor 1206)
R72  value 10R  [0603 (1608 Metric)]  (hidden comment: Resistor 0603)
R73  value 0R  [1206]  (hidden comment: Resistor 1206)
R74  value 402k  [1206]  (hidden comment: Resistor 1206)
R75  value 0R  [0603 (1608 Metric)]  (hidden comment: Resistor 0603)
R76  value 12R  [1206]  (hidden comment: Resistor 1206)
R176  value 0R  [0603 (1608 Metric)]  (hidden comment: Resistor 0603)
R177  value 0R  [0603 (1608 Metric)]  (hidden comment: Resistor 0603)
R178  value 0R  [0603 (1608 Metric)]  (hidden comment: Resistor 0603)
R201  value NC  [1206]  (hidden comment: Resistor 1206)
R202  value NC  [1206]  (hidden comment: Resistor 1206)
R203  value 0R  [1206]  (hidden comment: Resistor 1206)
R205  value NC  [1206]  (hidden comment: Resistor 1206)
R206  value 0R  [1206]  (hidden comment: Resistor 1206)
R207  value NC  [1206]  (hidden comment: Resistor 1206)
T4  750313769  [Xmr SN6501]  (value not drawn)
U13  TLV70450DBV  [SOT23-5]
U14  SN6501  [SOT23-5]
U15  TPS7A30  [8-TSSOP]
U16  AMC1100  [SOIC8]
U17  AMC1100  [SOIC8]
U18  AMC1100  [SOIC8]

### Ports
OUT_VAN, OUT_VAP, OUT_VBN, OUT_VBP, OUT_VCN, OUT_VCP, VA, VB, VC

### Nets
+5V_LV: C86.2(OUT) C87.2(OUT) C88.2(OUT) C106.1(OUT) C108.1(OUT) C111.1(OUT) C113.1(OUT) C116.1(OUT) C118.1(OUT) T4.2 U14.2(VCC) U16.8(V+) U17.8(V+) U18.8(V+)
+5V_PH: C92.2(OUT) C93.2(OUT) C105.2(OUT) C107.2(OUT) C110.2(OUT) C112.2(OUT) C115.2(OUT) C117.2(OUT) D26.A D27.1(Anode) D31.2(node) D32.2(node) D33.2(node) D34.2(node) D35.2(node) D36.2(node) FB13.2(OUT) R41.2(A) R53.2(A) R65.2(A) U16.1(V+) U17.1(V+) U18.1(V+)
+6V_PH: C89.2(OUT) C90.2(OUT) C96.2(OUT) C97.2(OUT) D25.2(Anode) U13.2(IN)
-5V_PH: C101.2(OUT) C102.2(OUT) D29.K D30.2(Anode) D31.1(node) D32.1(node) D33.1(node) D34.1(node) D35.1(node) D36.1(node) FB14.2(OUT)
-6V_PH: C94.1(OUT) C95.1(OUT) C98.2(OUT) C99.2(OUT) D28.1(Anode) U15.5(EN) U15.8(VIN)
GND_LV: C85.1 C86.1(OUT) C87.1(OUT) C88.1(OUT) C106.2(OUT) C108.2(OUT) C111.2(OUT) C113.2(OUT) C116.2(OUT) C118.2(OUT) U14.4(GND) U14.5(GND) U16.5(V-) U17.5(V-) U18.5(V-)
GND_PH: C85.2 C89.1(OUT) C90.1(OUT) C91.1(OUT) C92.1(OUT) C93.1(OUT) C94.2(OUT) C95.2(OUT) C96.1(OUT) C97.1(OUT) C98.1(OUT) C99.1(OUT) C101.1(OUT) C102.1(OUT) C103.1(OUT) C104.1(OUT) C105.1(OUT) C107.1(OUT) C110.1(OUT) C112.1(OUT) C115.1(OUT) C117.1(OUT) D27.2(Anode) D30.1(Anode) R37.1(A) R39.1(A) R40.1(A) R51.1(A) R52.1(A) R63.1(A) R64.1(A) R75.1(A) R76.1(A) T4.4 U13.1(GND) U15.3(NC) U15.4(GND) U15.9(TPAD) U16.4(V-) U17.4(V-) U18.4(V-)
N_HV: R203.1(A) R206.1(A) R207.1(A)
NetC91_2: C91.2(OUT) FB13.1(OUT) U13.3(OUT)
NetC100_1: C100.1(OUT) C103.2(OUT) FB14.1(OUT) R38.2(A) U15.1(OUT)
NetC100_2: C100.2(OUT) R38.1(A) R40.2(A) U15.2(FB)
NetC104_2: C104.2(OUT) U15.6(NR/SS)
NetC109_1: C109.1(OUT) D31.3(node) R41.1(A) R44.2(A) U16.2(+)
NetC109_2: C109.2(OUT) D32.3(node) R52.2(A) U16.3(-)
NetC114_1: C114.1(OUT) D33.3(node) R53.1(A) R56.2(A) U17.2(+)
NetC114_2: C114.2(OUT) D34.3(node) R64.2(A) U17.3(-)
NetC119_1: C119.1(OUT) D35.3(node) R65.1(A) R68.2(A) U18.2(+)
NetC119_2: C119.2(OUT) D36.3(node) R76.2(A) U18.3(-)
NetD25_1: D25.1(Anode) D28.2(Anode) T4.6
NetD26_K: D26.K R37.2(A)
NetD29_A: D29.A R39.2(A)
NetFB15_1: FB15.1(OUT) R201.1(A) ; port VC
NetFB15_2: FB15.2(OUT) R42.1(A)
NetFB16_1: FB16.1(OUT) ; port VB
NetFB16_2: FB16.2(OUT) R54.1(A)
NetFB17_1: FB17.1(OUT) ; port VA
NetFB17_2: FB17.2(OUT) R66.1(A)
NetR42_2: R42.2(A) R43.1(A)
NetR43_2: R43.2(A) R49.1(A)
NetR44_1: R44.1(A) R178.1(A)
NetR45_1: R45.1(A) U16.7(+)
NetR45_2: R45.2(A) ; port OUT_VCP
NetR46_1: R46.1(A) R47.1(A) R51.2(A) R207.2(A)
NetR46_2: R46.2(A) R47.2(A) R50.2(A) R178.2(A)
NetR48_1: R48.1(A) U16.6(-)
NetR48_2: R48.2(A) ; port OUT_VCN
NetR49_2: R49.2(A) R50.1(A)
NetR54_2: R54.2(A) R55.1(A)
NetR55_2: R55.2(A) R61.1(A)
NetR56_1: R56.1(A) R177.1(A)
NetR57_1: R57.1(A) U17.7(+)
NetR57_2: R57.2(A) ; port OUT_VBP
NetR58_1: R58.1(A) R59.1(A) R63.2(A) R205.2(A) R206.2(A)
NetR58_2: R58.2(A) R59.2(A) R62.2(A) R177.2(A)
NetR60_1: R60.1(A) U17.6(-)
NetR60_2: R60.2(A) ; port OUT_VBN
NetR61_2: R61.2(A) R62.1(A)
NetR66_2: R66.2(A) R67.1(A)
NetR67_2: R67.2(A) R73.1(A)
NetR68_1: R68.1(A) R176.1(A)
NetR69_1: R69.1(A) U18.7(+)
NetR69_2: R69.2(A) ; port OUT_VAP
NetR70_1: R70.1(A) R71.1(A) R75.2(A) R202.2(A) R203.2(A)
NetR70_2: R70.2(A) R71.2(A) R74.2(A) R176.2(A)
NetR72_1: R72.1(A) U18.6(-)
NetR72_2: R72.2(A) ; port OUT_VAN
NetR73_2: R73.2(A) R74.1(A)
NetR201_2: R201.2(A) R202.1(A) R205.1(A)
NetT4_1: T4.1 U14.3(D2)
NetT4_3: T4.3 U14.1(D1)

Not connected (* = marked no-connect by the designer): T4 5(1); U13 4(NC) 5(NC); U15 7(DNC)

### Notes on the sheet
- Dual Power Supply
- Voltage Sensors
- Phase A
- Phase B
- Phase C

### Library data of the parts
C85 = Cap: as C15 on sheet Ind_current_sensor; Published: 8-Jun-2000; LatestRevisionDate: 17-Jul-2002; LatestRevisionNote: Re-released for DXP Platform.; PackageReference: RAD-0.3; Publisher: Altium Limited; PackageDescription: Radial Cap, Thru-Hole; 2 Leads; 0.3 in Pin Spacing
C86 C89 C91 C94 C96 C98 C103 = Cap 0603_new: as C16 on sheet Ind_current_sensor
C87 = Cap 0805: as C17 on sheet Ind_current_sensor
C88 C90 C92 C95 C97 C99 C101 C107 C108 C112 C113 C117 C118 = Cap 0603_new: as C12 on sheet Ind_current_sensor
C93 C102 = Cap 0805: as C23 on sheet Ind_current_sensor
C100 C104 = Cap 0603_new: as C30 on sheet Ind_current_sensor
C105 C106 C110 C111 C115 C116 = Cap 0603_new: as C10 on sheet Ind_current_sensor
C109 C114 C119 = Cap 0603_new: as C14 on sheet Ind_current_sensor
D25 D28 = Diode MBR0520: as D3 on sheet Ind_current_sensor; Value: *
D26 D29 = LED: LED 0805
D27 D30 = Diode Zener POWERDI123: Part: DFLZ6V2DICT-ND; Value: *
D31-D36 = Diode_ESD: TVS DIODE; Part: ESD1P0RFWH6327XTSA1CT
FB13-FB17 = Ferrite bead: as FB1 on sheet Ind_current_sensor
R37 R39 = Resistor 0603: as R15 on sheet Ind_current_sensor
R38 = Resistor 0603: as R16 on sheet Ind_current_sensor
R40 = Resistor 0603: as R18 on sheet Ind_current_sensor
R41 R53 R65 = Resistor 0603
R42 R43 R49 R201 R202 R205 R207 = Resistor 1206: RES SMD 332K OHM 0.1% 1/4W 1206; Part: RG32P332KBCT-ND
R44 R52 R56 R64 R68 R76 = Resistor 1206: as R11 on sheet Ind_current_sensor
R45 R48 R57 R60 R69 R72 = Resistor 0603: as R12 on sheet Ind_current_sensor
R46 R58 R70 = Resistor 1206: RES SMD 1K OHM 0.1% 1/4W 1206; Part: P1.0KBCCT-ND
R50 R62 R74 = Resistor 1206: RES SMD 402K OHM 0.1% 1/4W 1206; Part: P402KBCCT-ND
R54 R55 R61 R67 R73 R203 R206 = Resistor 1206: 0R
R66 = Resistor 1206: NC
T4 = 750313769: as T1 on sheet Ind_current_sensor
U13 = TLV70450DBV: as U2 on sheet Ind_current_sensor
U14 = SN6501: as U3 on sheet Ind_current_sensor; Value: *
U15 = TPS7A30: as U4 on sheet Ind_current_sensor
U16-U18 = AMC1100: as U1 on sheet Ind_current_sensor

## Sheet Out_current_sensor_UVW.SchDoc
size 508 x 508 mm
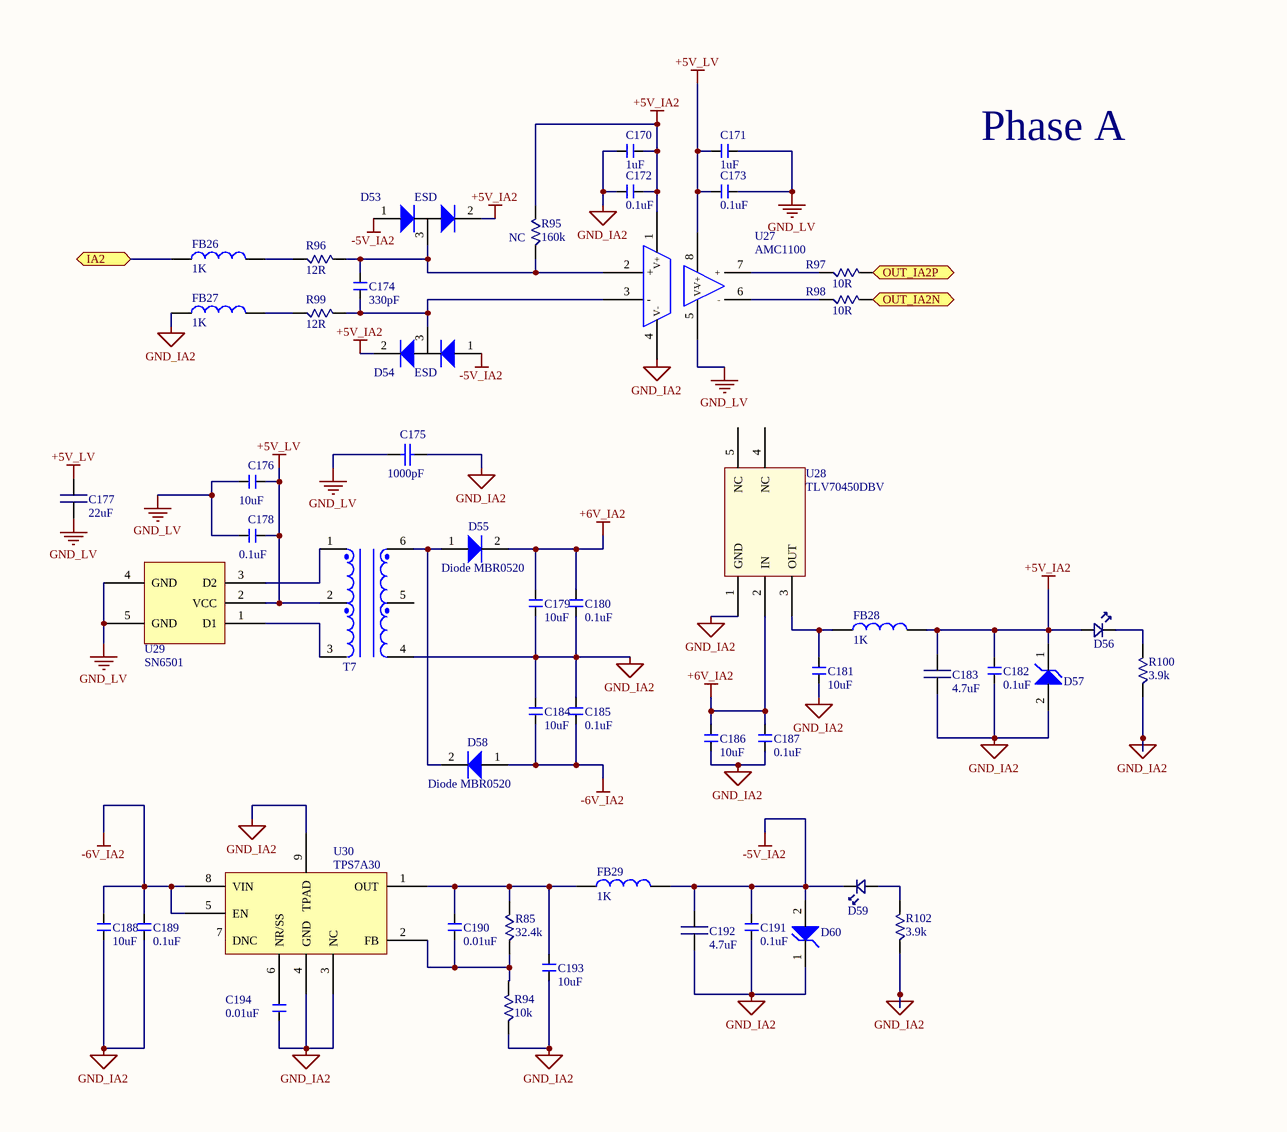
[diagram p5: Out_current_sensor_UVW.SchDoc, top left]
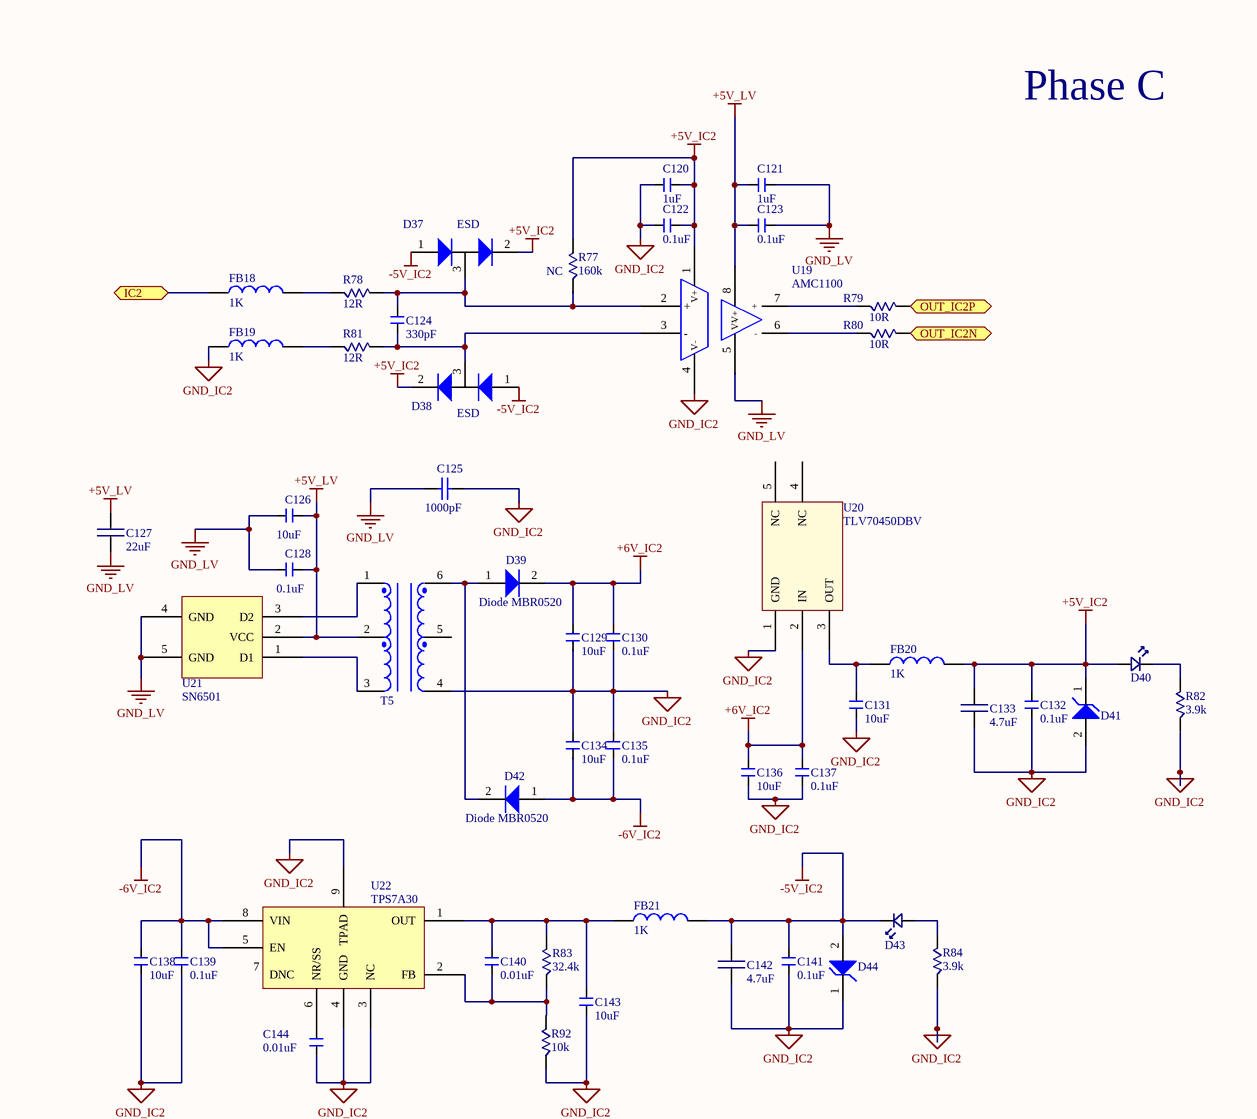
[diagram p6: Out_current_sensor_UVW.SchDoc, top right]
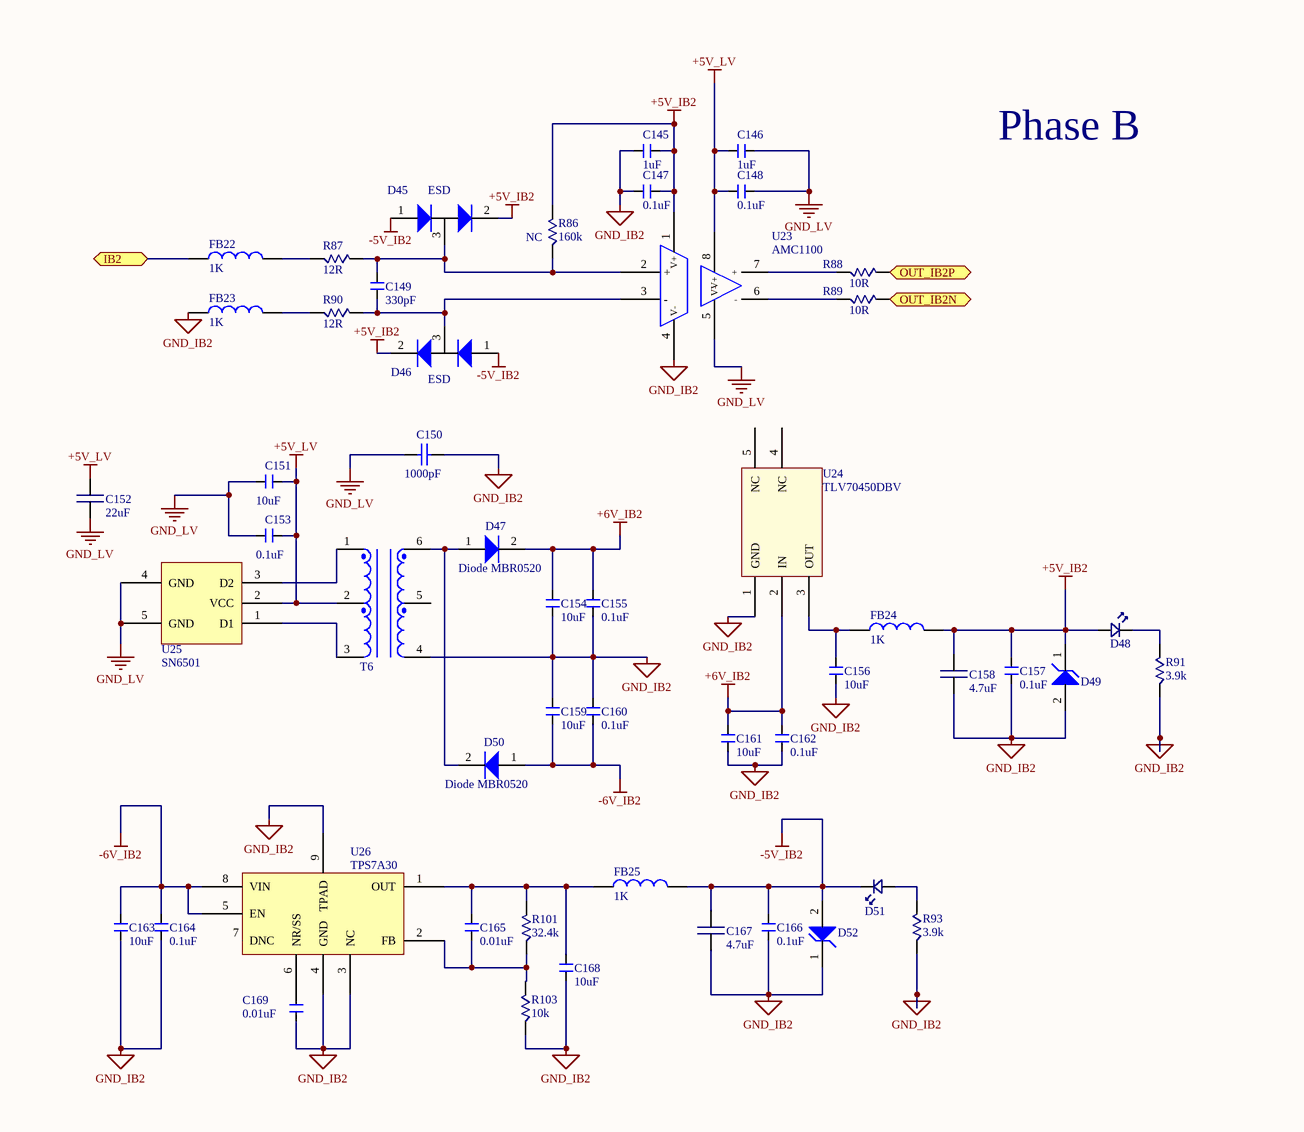
[diagram p7: Out_current_sensor_UVW.SchDoc, bottom left]

### Parts
C120  value 1uF  [0603 (1608 Metric)]  (hidden comment: Cap 0603_new)
C121  value 1uF  [0603 (1608 Metric)]  (hidden comment: Cap 0603_new)
C122  value 0.1uF  [0603 (1608 Metric)]  (hidden comment: Cap 0603_new)
C123  value 0.1uF  [0603 (1608 Metric)]  (hidden comment: Cap 0603_new)
C124  value 330pF  [0603 (1608 Metric)]  (hidden comment: Cap 0603_new)
C125  value 1000pF  [RAD-0.3]  (hidden comment: Cap TH)
C126  value 10uF  [0603 (1608 Metric)]  (hidden comment: Cap 0603_new)
C127  value 22uF  [0805 (2012 metric)]  (hidden comment: Cap 0805)
C128  value 0.1uF  [0603 (1608 Metric)]  (hidden comment: Cap 0603_new)
C129  value 10uF  [0603 (1608 Metric)]  (hidden comment: Cap 0603_new)
C130  value 0.1uF  [0603 (1608 Metric)]  (hidden comment: Cap 0603_new)
C131  value 10uF  [0603 (1608 Metric)]  (hidden comment: Cap 0603_new)
C132  value 0.1uF  [0603 (1608 Metric)]  (hidden comment: Cap 0603_new)
C133  value 4.7uF  [0805 (2012 metric)]  (hidden comment: Cap 0805)
C134  value 10uF  [0603 (1608 Metric)]  (hidden comment: Cap 0603_new)
C135  value 0.1uF  [0603 (1608 Metric)]  (hidden comment: Cap 0603_new)
C136  value 10uF  [0603 (1608 Metric)]  (hidden comment: Cap 0603_new)
C137  value 0.1uF  [0603 (1608 Metric)]  (hidden comment: Cap 0603_new)
C138  value 10uF  [0603 (1608 Metric)]  (hidden comment: Cap 0603_new)
C139  value 0.1uF  [0603 (1608 Metric)]  (hidden comment: Cap 0603_new)
C140  value 0.01uF  [0603 (1608 Metric)]  (hidden comment: Cap 0603_new)
C141  value 0.1uF  [0603 (1608 Metric)]  (hidden comment: Cap 0603_new)
C142  value 4.7uF  [0805 (2012 metric)]  (hidden comment: Cap 0805)
C143  value 10uF  [0603 (1608 Metric)]  (hidden comment: Cap 0603_new)
C144  value 0.01uF  [0603 (1608 Metric)]  (hidden comment: Cap 0603_new)
C145  value 1uF  [0603 (1608 Metric)]  (hidden comment: Cap 0603_new)
C146  value 1uF  [0603 (1608 Metric)]  (hidden comment: Cap 0603_new)
C147  value 0.1uF  [0603 (1608 Metric)]  (hidden comment: Cap 0603_new)
C148  value 0.1uF  [0603 (1608 Metric)]  (hidden comment: Cap 0603_new)
C149  value 330pF  [0603 (1608 Metric)]  (hidden comment: Cap 0603_new)
C150  value 1000pF  [RAD-0.3]  (hidden comment: Cap TH)
C151  value 10uF  [0603 (1608 Metric)]  (hidden comment: Cap 0603_new)
C152  value 22uF  [0805 (2012 metric)]  (hidden comment: Cap 0805)
C153  value 0.1uF  [0603 (1608 Metric)]  (hidden comment: Cap 0603_new)
C154  value 10uF  [0603 (1608 Metric)]  (hidden comment: Cap 0603_new)
C155  value 0.1uF  [0603 (1608 Metric)]  (hidden comment: Cap 0603_new)
C156  value 10uF  [0603 (1608 Metric)]  (hidden comment: Cap 0603_new)
C157  value 0.1uF  [0603 (1608 Metric)]  (hidden comment: Cap 0603_new)
C158  value 4.7uF  [0805 (2012 metric)]  (hidden comment: Cap 0805)
C159  value 10uF  [0603 (1608 Metric)]  (hidden comment: Cap 0603_new)
C160  value 0.1uF  [0603 (1608 Metric)]  (hidden comment: Cap 0603_new)
C161  value 10uF  [0603 (1608 Metric)]  (hidden comment: Cap 0603_new)
C162  value 0.1uF  [0603 (1608 Metric)]  (hidden comment: Cap 0603_new)
C163  value 10uF  [0603 (1608 Metric)]  (hidden comment: Cap 0603_new)
C164  value 0.1uF  [0603 (1608 Metric)]  (hidden comment: Cap 0603_new)
C165  value 0.01uF  [0603 (1608 Metric)]  (hidden comment: Cap 0603_new)
C166  value 0.1uF  [0603 (1608 Metric)]  (hidden comment: Cap 0603_new)
C167  value 4.7uF  [0805 (2012 metric)]  (hidden comment: Cap 0805)
C168  value 10uF  [0603 (1608 Metric)]  (hidden comment: Cap 0603_new)
C169  value 0.01uF  [0603 (1608 Metric)]  (hidden comment: Cap 0603_new)
C170  value 1uF  [0603 (1608 Metric)]  (hidden comment: Cap 0603_new)
C171  value 1uF  [0603 (1608 Metric)]  (hidden comment: Cap 0603_new)
C172  value 0.1uF  [0603 (1608 Metric)]  (hidden comment: Cap 0603_new)
C173  value 0.1uF  [0603 (1608 Metric)]  (hidden comment: Cap 0603_new)
C174  value 330pF  [0603 (1608 Metric)]  (hidden comment: Cap 0603_new)
C175  value 1000pF  [RAD-0.3]  (hidden comment: Cap TH)
C176  value 10uF  [0603 (1608 Metric)]  (hidden comment: Cap 0603_new)
C177  value 22uF  [0805 (2012 metric)]  (hidden comment: Cap 0805)
C178  value 0.1uF  [0603 (1608 Metric)]  (hidden comment: Cap 0603_new)
C179  value 10uF  [0603 (1608 Metric)]  (hidden comment: Cap 0603_new)
C180  value 0.1uF  [0603 (1608 Metric)]  (hidden comment: Cap 0603_new)
C181  value 10uF  [0603 (1608 Metric)]  (hidden comment: Cap 0603_new)
C182  value 0.1uF  [0603 (1608 Metric)]  (hidden comment: Cap 0603_new)
C183  value 4.7uF  [0805 (2012 metric)]  (hidden comment: Cap 0805)
C184  value 10uF  [0603 (1608 Metric)]  (hidden comment: Cap 0603_new)
C185  value 0.1uF  [0603 (1608 Metric)]  (hidden comment: Cap 0603_new)
C186  value 10uF  [0603 (1608 Metric)]  (hidden comment: Cap 0603_new)
C187  value 0.1uF  [0603 (1608 Metric)]  (hidden comment: Cap 0603_new)
C188  value 10uF  [0603 (1608 Metric)]  (hidden comment: Cap 0603_new)
C189  value 0.1uF  [0603 (1608 Metric)]  (hidden comment: Cap 0603_new)
C190  value 0.01uF  [0603 (1608 Metric)]  (hidden comment: Cap 0603_new)
C191  value 0.1uF  [0603 (1608 Metric)]  (hidden comment: Cap 0603_new)
C192  value 4.7uF  [0805 (2012 metric)]  (hidden comment: Cap 0805)
C193  value 10uF  [0603 (1608 Metric)]  (hidden comment: Cap 0603_new)
C194  value 0.01uF  [0603 (1608 Metric)]  (hidden comment: Cap 0603_new)
D37  value ESD  [SOT323_ESD]  (hidden comment: TVS - Diodes)
D38  value ESD  [SOT323_ESD]  (hidden comment: TVS - Diodes)
D39  Diode MBR0520  [SOD-123]
D40  LED  [0805 (2012 Metric) Diode]  (value not drawn)
D41  Diode Zener POWERDI123  [POWERDI]  (value not drawn)
D42  Diode MBR0520  [SOD-123]
D43  LED  [0805 (2012 Metric) Diode]  (value not drawn)
D44  Diode Zener POWERDI123  [POWERDI]  (value not drawn)
D45  value ESD  [SOT323_ESD]  (hidden comment: TVS - Diodes)
D46  value ESD  [SOT323_ESD]  (hidden comment: TVS - Diodes)
D47  Diode MBR0520  [SOD-123]
D48  LED  [0805 (2012 Metric) Diode]  (value not drawn)
D49  Diode Zener POWERDI123  [POWERDI]  (value not drawn)
D50  Diode MBR0520  [SOD-123]
D51  LED  [0805 (2012 Metric) Diode]  (value not drawn)
D52  Diode Zener POWERDI123  [POWERDI]  (value not drawn)
D53  value ESD  [SOT323_ESD]  (hidden comment: TVS - Diodes)
D54  value ESD  [SOT323_ESD]  (hidden comment: TVS - Diodes)
D55  Diode MBR0520  [SOD-123]
D56  LED  [0805 (2012 Metric) Diode]  (value not drawn)
D57  Diode Zener POWERDI123  [POWERDI]  (value not drawn)
D58  Diode MBR0520  [SOD-123]
D59  LED  [0805 (2012 Metric) Diode]  (value not drawn)
D60  Diode Zener POWERDI123  [POWERDI]  (value not drawn)
FB18  value 1K  [0603 (1608 Metric)]  (hidden comment: Ferrite bead)
FB19  value 1K  [0603 (1608 Metric)]  (hidden comment: Ferrite bead)
FB20  value 1K  [0603 (1608 Metric)]  (hidden comment: Ferrite bead)
FB21  value 1K  [0603 (1608 Metric)]  (hidden comment: Ferrite bead)
FB22  value 1K  [0603 (1608 Metric)]  (hidden comment: Ferrite bead)
FB23  value 1K  [0603 (1608 Metric)]  (hidden comment: Ferrite bead)
FB24  value 1K  [0603 (1608 Metric)]  (hidden comment: Ferrite bead)
FB25  value 1K  [0603 (1608 Metric)]  (hidden comment: Ferrite bead)
FB26  value 1K  [0603 (1608 Metric)]  (hidden comment: Ferrite bead)
FB27  value 1K  [0603 (1608 Metric)]  (hidden comment: Ferrite bead)
FB28  value 1K  [0603 (1608 Metric)]  (hidden comment: Ferrite bead)
FB29  value 1K  [0603 (1608 Metric)]  (hidden comment: Ferrite bead)
R77  NC  value 160k  [0603 (1608 Metric)]
R78  value 12R  [1206]  (hidden comment: Resistor 1206)
R79  value 10R  [0603 (1608 Metric)]  (hidden comment: Resistor 0603)
R80  value 10R  [0603 (1608 Metric)]  (hidden comment: Resistor 0603)
R81  value 12R  [1206]  (hidden comment: Resistor 1206)
R82  value 3.9k  [0603 (1608 Metric)]  (hidden comment: Resistor 0603)
R83  value 32.4k  [0603 (1608 Metric)]  (hidden comment: Resistor 0603)
R84  value 3.9k  [0603 (1608 Metric)]  (hidden comment: Resistor 0603)
R85  value 32.4k  [0603 (1608 Metric)]  (hidden comment: Resistor 0603)
R86  NC  value 160k  [0603 (1608 Metric)]
R87  value 12R  [1206]  (hidden comment: Resistor 1206)
R88  value 10R  [0603 (1608 Metric)]  (hidden comment: Resistor 0603)
R89  value 10R  [0603 (1608 Metric)]  (hidden comment: Resistor 0603)
R90  value 12R  [1206]  (hidden comment: Resistor 1206)
R91  value 3.9k  [0603 (1608 Metric)]  (hidden comment: Resistor 0603)
R92  value 10k  [0603 (1608 Metric)]  (hidden comment: Resistor 0603)
R93  value 3.9k  [0603 (1608 Metric)]  (hidden comment: Resistor 0603)
R94  value 10k  [0603 (1608 Metric)]  (hidden comment: Resistor 0603)
R95  NC  value 160k  [0603 (1608 Metric)]
R96  value 12R  [1206]  (hidden comment: Resistor 1206)
R97  value 10R  [0603 (1608 Metric)]  (hidden comment: Resistor 0603)
R98  value 10R  [0603 (1608 Metric)]  (hidden comment: Resistor 0603)
R99  value 12R  [1206]  (hidden comment: Resistor 1206)
R100  value 3.9k  [0603 (1608 Metric)]  (hidden comment: Resistor 0603)
R101  value 32.4k  [0603 (1608 Metric)]  (hidden comment: Resistor 0603)
R102  value 3.9k  [0603 (1608 Metric)]  (hidden comment: Resistor 0603)
R103  value 10k  [0603 (1608 Metric)]  (hidden comment: Resistor 0603)
T5  750313769  [Xmr SN6501]  (value not drawn)
T6  750313769  [Xmr SN6501]  (value not drawn)
T7  750313769  [Xmr SN6501]  (value not drawn)
U19  AMC1100  [SOIC8]
U20  TLV70450DBV  [SOT23-5]
U21  SN6501  [SOT23-5]
U22  TPS7A30  [8-TSSOP]
U23  AMC1100  [SOIC8]
U24  TLV70450DBV  [SOT23-5]
U25  SN6501  [SOT23-5]
U26  TPS7A30  [8-TSSOP]
U27  AMC1100  [SOIC8]
U28  TLV70450DBV  [SOT23-5]
U29  SN6501  [SOT23-5]
U30  TPS7A30  [8-TSSOP]

### Ports
IA2, IB2, IC2, OUT_IA2N, OUT_IA2P, OUT_IB2N, OUT_IB2P, OUT_IC2N, OUT_IC2P

### Nets
+5V_IA2: C170.2(OUT) C172.2(OUT) C182.2(OUT) C183.2(OUT) D53.2(node) D54.2(node) D56.A D57.1(Anode) FB28.2(OUT) R95.2(A) U27.1(V+)
+5V_IB2: C145.2(OUT) C147.2(OUT) C157.2(OUT) C158.2(OUT) D45.2(node) D46.2(node) D48.A D49.1(Anode) FB24.2(OUT) R86.2(A) U23.1(V+)
+5V_IC2: C120.2(OUT) C122.2(OUT) C132.2(OUT) C133.2(OUT) D37.2(node) D38.2(node) D40.A D41.1(Anode) FB20.2(OUT) R77.2(A) U19.1(V+)
+5V_LV: C121.1(OUT) C123.1(OUT) C126.2(OUT) C127.2(OUT) C128.2(OUT) C146.1(OUT) C148.1(OUT) C151.2(OUT) C152.2(OUT) C153.2(OUT) C171.1(OUT) C173.1(OUT) C176.2(OUT) C177.2(OUT) C178.2(OUT) T5.2 T6.2 T7.2 U19.8(V+) U21.2(VCC) U23.8(V+) U25.2(VCC) U27.8(V+) U29.2(VCC)
+6V_IA2: C179.2(OUT) C180.2(OUT) C186.2(OUT) C187.2(OUT) D55.2(Anode) U28.2(IN)
+6V_IB2: C154.2(OUT) C155.2(OUT) C161.2(OUT) C162.2(OUT) D47.2(Anode) U24.2(IN)
+6V_IC2: C129.2(OUT) C130.2(OUT) C136.2(OUT) C137.2(OUT) D39.2(Anode) U20.2(IN)
-5V_IA2: C191.2(OUT) C192.2(OUT) D53.1(node) D54.1(node) D59.K D60.2(Anode) FB29.2(OUT)
-5V_IB2: C166.2(OUT) C167.2(OUT) D45.1(node) D46.1(node) D51.K D52.2(Anode) FB25.2(OUT)
-5V_IC2: C141.2(OUT) C142.2(OUT) D37.1(node) D38.1(node) D43.K D44.2(Anode) FB21.2(OUT)
-6V_IA2: C184.1(OUT) C185.1(OUT) C188.2(OUT) C189.2(OUT) D58.1(Anode) U30.5(EN) U30.8(VIN)
-6V_IB2: C159.1(OUT) C160.1(OUT) C163.2(OUT) C164.2(OUT) D50.1(Anode) U26.5(EN) U26.8(VIN)
-6V_IC2: C134.1(OUT) C135.1(OUT) C138.2(OUT) C139.2(OUT) D42.1(Anode) U22.5(EN) U22.8(VIN)
GND_IA2: C170.1(OUT) C172.1(OUT) C175.2 C179.1(OUT) C180.1(OUT) C181.1(OUT) C182.1(OUT) C183.1(OUT) C184.2(OUT) C185.2(OUT) C186.1(OUT) C187.1(OUT) C188.1(OUT) C189.1(OUT) C191.1(OUT) C192.1(OUT) C193.1(OUT) C194.1(OUT) D57.2(Anode) D60.1(Anode) FB27.1(OUT) R94.1(A) R100.1(A) R102.1(A) T7.4 U27.4(V-) U28.1(GND) U30.3(NC) U30.4(GND) U30.9(TPAD)
GND_IB2: C145.1(OUT) C147.1(OUT) C150.2 C154.1(OUT) C155.1(OUT) C156.1(OUT) C157.1(OUT) C158.1(OUT) C159.2(OUT) C160.2(OUT) C161.1(OUT) C162.1(OUT) C163.1(OUT) C164.1(OUT) C166.1(OUT) C167.1(OUT) C168.1(OUT) C169.1(OUT) D49.2(Anode) D52.1(Anode) FB23.1(OUT) R91.1(A) R93.1(A) R103.1(A) T6.4 U23.4(V-) U24.1(GND) U26.3(NC) U26.4(GND) U26.9(TPAD)
GND_IC2: C120.1(OUT) C122.1(OUT) C125.2 C129.1(OUT) C130.1(OUT) C131.1(OUT) C132.1(OUT) C133.1(OUT) C134.2(OUT) C135.2(OUT) C136.1(OUT) C137.1(OUT) C138.1(OUT) C139.1(OUT) C141.1(OUT) C142.1(OUT) C143.1(OUT) C144.1(OUT) D41.2(Anode) D44.1(Anode) FB19.1(OUT) R82.1(A) R84.1(A) R92.1(A) T5.4 U19.4(V-) U20.1(GND) U22.3(NC) U22.4(GND) U22.9(TPAD)
GND_LV: C121.2(OUT) C123.2(OUT) C125.1 C126.1(OUT) C127.1(OUT) C128.1(OUT) C146.2(OUT) C148.2(OUT) C150.1 C151.1(OUT) C152.1(OUT) C153.1(OUT) C171.2(OUT) C173.2(OUT) C175.1 C176.1(OUT) C177.1(OUT) C178.1(OUT) U19.5(V-) U21.4(GND) U21.5(GND) U23.5(V-) U25.4(GND) U25.5(GND) U27.5(V-) U29.4(GND) U29.5(GND)
NetC124_1: C124.1(OUT) D37.3(node) R77.1(A) R78.2(A) U19.2(+)
NetC124_2: C124.2(OUT) D38.3(node) R81.2(A) U19.3(-)
NetC131_2: C131.2(OUT) FB20.1(OUT) U20.3(OUT)
NetC140_1: C140.1(OUT) C143.2(OUT) FB21.1(OUT) R83.2(A) U22.1(OUT)
NetC140_2: C140.2(OUT) R83.1(A) R92.2(A) U22.2(FB)
NetC144_2: C144.2(OUT) U22.6(NR/SS)
NetC149_1: C149.1(OUT) D45.3(node) R86.1(A) R87.2(A) U23.2(+)
NetC149_2: C149.2(OUT) D46.3(node) R90.2(A) U23.3(-)
NetC156_2: C156.2(OUT) FB24.1(OUT) U24.3(OUT)
NetC165_1: C165.1(OUT) C168.2(OUT) FB25.1(OUT) R101.2(A) U26.1(OUT)
NetC165_2: C165.2(OUT) R101.1(A) R103.2(A) U26.2(FB)
NetC169_2: C169.2(OUT) U26.6(NR/SS)
NetC174_1: C174.1(OUT) D53.3(node) R95.1(A) R96.2(A) U27.2(+)
NetC174_2: C174.2(OUT) D54.3(node) R99.2(A) U27.3(-)
NetC181_2: C181.2(OUT) FB28.1(OUT) U28.3(OUT)
NetC190_1: C190.1(OUT) C193.2(OUT) FB29.1(OUT) R85.2(A) U30.1(OUT)
NetC190_2: C190.2(OUT) R85.1(A) R94.2(A) U30.2(FB)
NetC194_2: C194.2(OUT) U30.6(NR/SS)
NetD39_1: D39.1(Anode) D42.2(Anode) T5.6
NetD40_K: D40.K R82.2(A)
NetD43_A: D43.A R84.2(A)
NetD47_1: D47.1(Anode) D50.2(Anode) T6.6
NetD48_K: D48.K R91.2(A)
NetD51_A: D51.A R93.2(A)
NetD55_1: D55.1(Anode) D58.2(Anode) T7.6
NetD56_K: D56.K R100.2(A)
NetD59_A: D59.A R102.2(A)
NetFB18_1: FB18.1(OUT) ; port IC2
NetFB18_2: FB18.2(OUT) R78.1(A)
NetFB19_2: FB19.2(OUT) R81.1(A)
NetFB22_1: FB22.1(OUT) ; port IB2
NetFB22_2: FB22.2(OUT) R87.1(A)
NetFB23_2: FB23.2(OUT) R90.1(A)
NetFB26_1: FB26.1(OUT) ; port IA2
NetFB26_2: FB26.2(OUT) R96.1(A)
NetFB27_2: FB27.2(OUT) R99.1(A)
NetR79_1: R79.1(A) U19.7(+)
NetR79_2: R79.2(A) ; port OUT_IC2P
NetR80_1: R80.1(A) U19.6(-)
NetR80_2: R80.2(A) ; port OUT_IC2N
NetR88_1: R88.1(A) U23.7(+)
NetR88_2: R88.2(A) ; port OUT_IB2P
NetR89_1: R89.1(A) U23.6(-)
NetR89_2: R89.2(A) ; port OUT_IB2N
NetR97_1: R97.1(A) U27.7(+)
NetR97_2: R97.2(A) ; port OUT_IA2P
NetR98_1: R98.1(A) U27.6(-)
NetR98_2: R98.2(A) ; port OUT_IA2N
NetT5_1: T5.1 U21.3(D2)
NetT5_3: T5.3 U21.1(D1)
NetT6_1: T6.1 U25.3(D2)
NetT6_3: T6.3 U25.1(D1)
NetT7_1: T7.1 U29.3(D2)
NetT7_3: T7.3 U29.1(D1)

Not connected (* = marked no-connect by the designer): T5 5(1); T6 5(1); T7 5(1); U20 4(NC) 5(NC); U22 7(DNC); U24 4(NC) 5(NC); U26 7(DNC); U28 4(NC) 5(NC); U30 7(DNC)

### Notes on the sheet
- Phase C
- Phase A
- Phase B

### Library data of the parts
C120 C121 C145 C146 C170 C171 = Cap 0603_new: as C10 on sheet Ind_current_sensor
C122 C123 C128 C130 C132 C135 C137 C139 C141 C147 C148 C153 C155 C157 C160 C162 C164 C166 C172 C173 C178 C180 C182 C185 C187 C189 C191 = Cap 0603_new: as C12 on sheet Ind_current_sensor
C124 C149 C174 = Cap 0603_new: as C14 on sheet Ind_current_sensor
C125 C150 C175 = Cap: as C15 on sheet Ind_current_sensor; Published: 8-Jun-2000; LatestRevisionDate: 17-Jul-2002; LatestRevisionNote: Re-released for DXP Platform.; PackageReference: RAD-0.3; Publisher: Altium Limited; PackageDescription: Radial Cap, Thru-Hole; 2 Leads; 0.3 in Pin Spacing
C126 C129 C131 C134 C136 C138 C143 C151 C154 C156 C159 C161 C163 C168 C176 C179 C181 C184 C186 C188 C193 = Cap 0603_new: as C16 on sheet Ind_current_sensor
C127 C152 C177 = Cap 0805: as C17 on sheet Ind_current_sensor
C133 C142 C158 C167 C183 C192 = Cap 0805: as C23 on sheet Ind_current_sensor
C140 C144 C165 C169 C190 C194 = Cap 0603_new: as C30 on sheet Ind_current_sensor
D37 D38 D45 D46 D53 D54 = Diode_ESD: TVS DIODE; Part: ESD1P0RFWH6327XTSA1CT
D39 D42 D47 D50 D55 D58 = Diode MBR0520: as D3 on sheet Ind_current_sensor; Value: *
D40 D43 D48 D51 D56 D59 = LED: LED 0805
D41 D44 D49 D52 D57 D60 = Diode Zener POWERDI123: Part: DFLZ6V2DICT-ND; Value: *
FB18-FB29 = Ferrite bead: as FB1 on sheet Ind_current_sensor
R77 R86 R95 = Resistor 0603
R78 R81 R87 R90 R96 R99 = Resistor 1206: as R11 on sheet Ind_current_sensor
R79 R80 R88 R89 R97 R98 = Resistor 0603: as R12 on sheet Ind_current_sensor
R82 R84 R91 R93 R100 R102 = Resistor 0603: as R15 on sheet Ind_current_sensor
R83 R85 R101 = Resistor 0603: as R16 on sheet Ind_current_sensor
R92 R94 R103 = Resistor 0603: as R18 on sheet Ind_current_sensor
T5-T7 = 750313769: as T1 on sheet Ind_current_sensor
U19 U23 U27 = AMC1100: as U1 on sheet Ind_current_sensor
U20 U24 U28 = TLV70450DBV: as U2 on sheet Ind_current_sensor
U21 U25 U29 = SN6501: as U3 on sheet Ind_current_sensor; Value: *
U22 U26 U30 = TPS7A30: as U4 on sheet Ind_current_sensor

## Nets that join several sheets
+5V_LV: Ind_current_sensor (24 pins), Voltage_sensor_UVW (14 pins), Out_current_sensor_UVW (24 pins)
GND_LV: Ind_current_sensor (27 pins), Voltage_sensor_UVW (15 pins), Out_current_sensor_UVW (27 pins)